# EAGLE design frames_v03 (EAGLE 5.09)

## Sheet 1 of 3
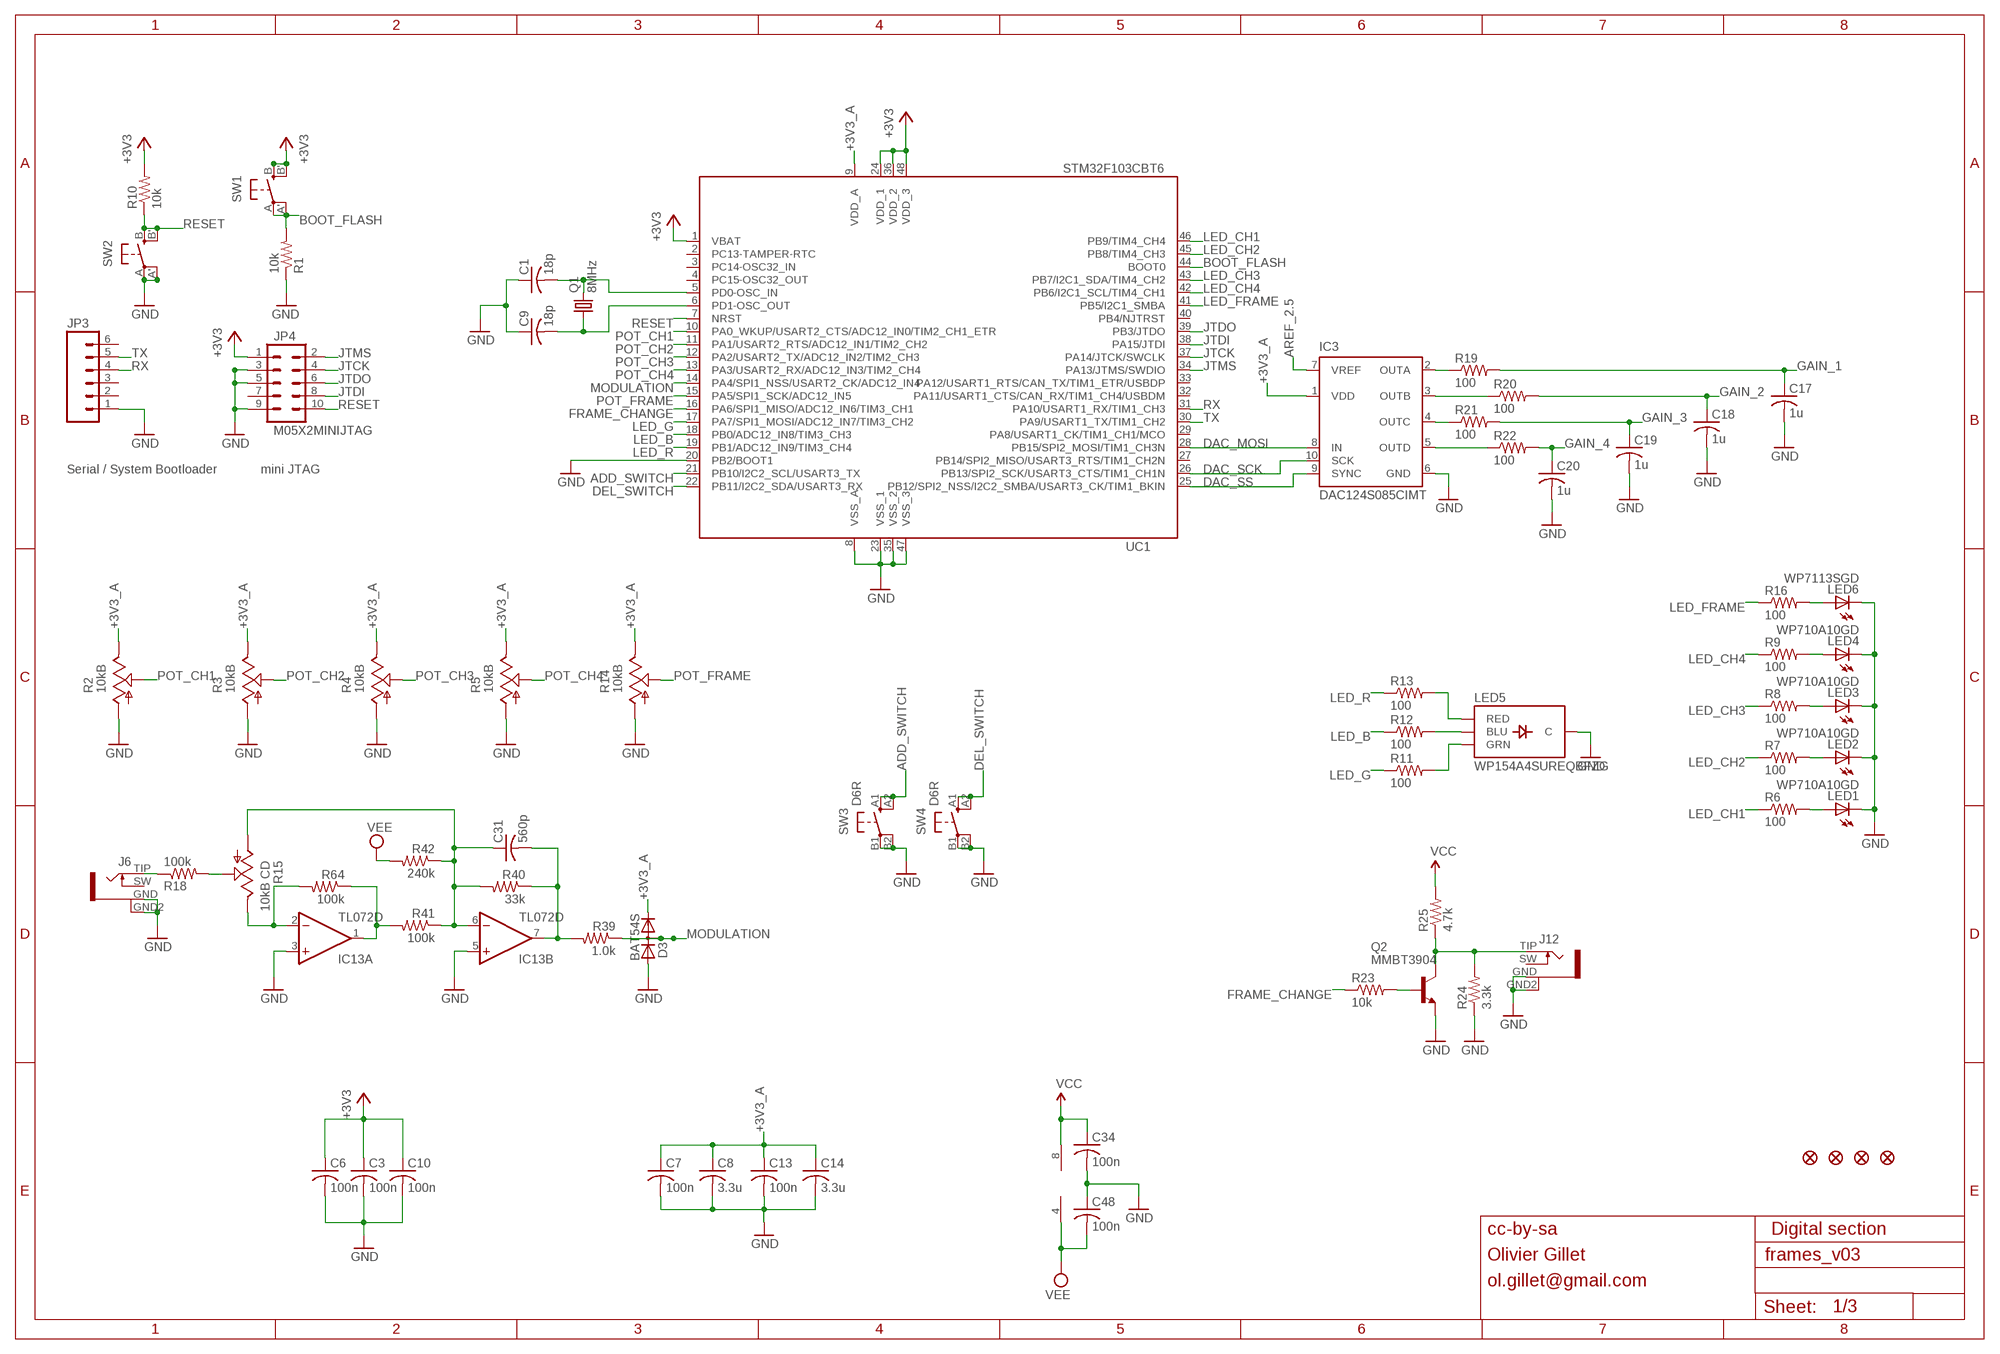
[diagram p0: schematic, sheet 1]

### Parts
C1  18p  C-USC0603  [C0603]
C3  100n  C-USC0603  [C0603]
C6  100n  C-USC0603  [C0603]
C7  100n  C-USC0603  [C0603]
C8  3.3u  C-USC0603  [C0603]
C9  18p  C-USC0603  [C0603]
C10  100n  C-USC0603  [C0603]
C13  100n  C-USC0603  [C0603]
C14  3.3u  C-USC0603  [C0603]
C17  1u  C-USC0603  [C0603]
C18  1u  C-USC0603  [C0603]
C19  1u  C-USC0603  [C0603]
C20  1u  C-USC0603  [C0603]
C31  560p  C-USC0603  [C0603]
C34  100n  C-USC0603  [C0603]
C48  100n  C-USC0603  [C0603]
D3  BAT54S  DIODE_2CACA-SOT23  [SOT23]
F1  FIDUCIAL1X2  [FIDUCIAL-1X2]
F2  FIDUCIAL1X2  [FIDUCIAL-1X2]
F3  FIDUCIAL1X2  [FIDUCIAL-1X2]
F4  FIDUCIAL1X2  [FIDUCIAL-1X2]
IC3  DAC124S085CIMT  [MSOP10]
IC13  TL072D  [SO08]
J6  PJ301WQP  [WQP_PJ_301BM]
J12  PJ301WQP  [WQP_PJ_301BM]
JP3  M06SIP  [1X06]
JP4  M05X2MINIJTAG  [2X5-1.27]
LED1  WP710A10GD  LED3MM  [LED3MM]
LED2  WP710A10GD  LED3MM  [LED3MM]
LED3  WP710A10GD  LED3MM  [LED3MM]
LED4  WP710A10GD  LED3MM  [LED3MM]
LED5  WP154A4SUREQBFZG  LED-TRICOLOR-THROUGHHOLE  [LED-TRICOLOR-THROUGHHOLE]
LED6  WP7113SGD  LED5MM  [LED5MM]
Q1  8MHz  CRYSTALHC49UP  [HC49UP]
Q2  MMBT3904  MMBT3904LT1-NPN-SOT23-BEC  [SOT23-BEC]
R1  10k  R-US_R0603  [R0603]
R2  10kB  POT_USVERTICAL_PS  [ALPS_POT_VERTICAL_PS]
R3  10kB  POT_USVERTICAL_PS  [ALPS_POT_VERTICAL_PS]
R4  10kB  POT_USVERTICAL_PS  [ALPS_POT_VERTICAL_PS]
R5  10kB  POT_USVERTICAL_PS  [ALPS_POT_VERTICAL_PS]
R6  100  R-US_R0603  [R0603]
R7  100  R-US_R0603  [R0603]
R8  100  R-US_R0603  [R0603]
R9  100  R-US_R0603  [R0603]
R10  10k  R-US_R0603  [R0603]
R11  100  R-US_R0603  [R0603]
R12  100  R-US_R0603  [R0603]
R13  100  R-US_R0603  [R0603]
R14  10kB  POT_USVERTICAL_PS  [ALPS_POT_VERTICAL_PS]
R15  10kB CD  POT_USVERTICAL_PS  [ALPS_POT_VERTICAL_PS]
R16  100  R-US_R0603  [R0603]
R18  100k  R-US_R0603  [R0603]
R19  100  R-US_R0603  [R0603]
R20  100  R-US_R0603  [R0603]
R21  100  R-US_R0603  [R0603]
R22  100  R-US_R0603  [R0603]
R23  10k  R-US_R0603  [R0603]
R24  3.3k  R-US_R0603  [R0603]
R25  4.7k  R-US_R0603  [R0603]
R39  1.0k  R-US_R0603  [R0603]
R40  33k  R-US_R0603  [R0603]
R41  100k  R-US_R0603  [R0603]
R42  240k  R-US_R0603  [R0603]
R64  100k  R-US_R0603  [R0603]
SW1  EVQQ2  [EVQ-Q2]
SW2  EVQQ2  [EVQ-Q2]
SW3  D6R  [D6R]
SW4  D6R  [D6R]
UC1  STM32F103CBT6  STM32F103CB  [LQFP48]

### Nets
+3V3: C3.1 C6.1 C10.1 JP4.1 R10.2 SW1.B'(S1) SW1.B(S) UC1.1(VBAT) UC1.24(VDD_1) UC1.36(VDD_2) UC1.48(VDD_3) ; also sheet 3
+3V3_A: C7.1 C8.1 C13.1 C14.1 D3.2(C) IC3.1(VDD) R2.P$1(E) R3.P$1(E) R4.P$1(E) R5.P$1(E) R14.P$1(E) UC1.9(VDD_A) ; also sheet 3
ADD_SWITCH: SW3.A1(S) SW3.A2(S1) UC1.21(PB10/I2C2_SCL/USART3_TX)
AREF_2.5: IC3.7(VREF) ; also sheet 3
BOOT_FLASH: R1.2 SW1.A'(P1) SW1.A(P) UC1.44(BOOT0)
DAC_MOSI: IC3.8(IN) UC1.28(PB15/SPI2_MOSI/TIM1_CH3N)
DAC_SCK: IC3.10(SCK) UC1.26(PB13/SPI2_SCK/USART3_CTS/TIM1_CH1N)
DAC_SS: IC3.9(SYNC) UC1.25(PB12/SPI2_NSS/I2C2_SMBA/USART3_CK/TIM1_BKIN)
DEL_SWITCH: SW4.A1(S) SW4.A2(S1) UC1.22(PB11/I2C2_SDA/USART3_RX)
FRAME_CHANGE: R23.1 UC1.16(PA6/SPI1_MISO/ADC12_IN6/TIM3_CH1)
GAIN_1: C17.1 R19.2 ; also sheet 2
GAIN_2: C18.1 R20.2 ; also sheet 2
GAIN_3: C19.1 R21.2 ; also sheet 2
GAIN_4: C20.1 R22.2 ; also sheet 2
GATE2_LED: LED3.A R8.2
GATE3_LED: LED2.A R7.2
GATE4_LED: LED1.A R6.2
GND: C1.1 C3.2 C6.2 C7.2 C8.2 C9.1 C10.2 C13.2 C14.2 C17.2 C18.2 C19.2 C20.2 C34.2 C48.1 D3.1(A) IC3.6(GND) IC13.3(A:+IN) IC13.5(B:+IN) J6.GND J6.GND2 J12.GND J12.GND2 JP3.1 JP4.3 JP4.5 JP4.9 LED1.K(C) LED2.K(C) LED3.K(C) LED4.K(C) LED5.GND(C) LED6.K(C) Q2.E R1.1 R2.P$3(A) R3.P$3(A) R4.P$3(A) R5.P$3(A) R14.P$3(A) R24.1 SW2.A'(P1) SW2.A(P) SW3.B1(P) SW3.B2(P1) SW4.B1(P) SW4.B2(P1) UC1.8(VSS_A) UC1.20(PB2/BOOT1) UC1.23(VSS_1) UC1.35(VSS_2) UC1.47(VSS_3) ; also sheet 2,3
JTCK: JP4.4 UC1.37(PA14/JTCK/SWCLK)
JTDI: JP4.8 UC1.38(PA15/JTDI)
JTDO: JP4.6 UC1.39(PB3/JTDO)
JTMS: JP4.2 UC1.34(PA13/JTMS/SWDIO)
LED_B: R12.1 UC1.18(PB0/ADC12_IN8/TIM3_CH3)
LED_CH1: R6.1 UC1.46(PB9/TIM4_CH4)
LED_CH2: R7.1 UC1.45(PB8/TIM4_CH3)
LED_CH3: R8.1 UC1.43(PB7/I2C1_SDA/TIM4_CH2)
LED_CH4: R9.1 UC1.42(PB6/I2C1_SCL/TIM4_CH1)
LED_FRAME: R16.1 UC1.41(PB5/I2C1_SMBA)
LED_G: R11.1 UC1.17(PA7/SPI1_MOSI/ADC12_IN7/TIM3_CH2)
LED_R: R13.1 UC1.19(PB1/ADC12_IN9/TIM3_CH4)
MODULATION: D3.3(AC) R39.1 UC1.14(PA4/SPI1_NSS/USART2_CK/ADC12_IN4)
N$1: IC13.2(A:-IN) R15.P$1(E) R64.2
N$5: R15.P$2(S) R18.2
N$6: LED4.A R9.2
N$7: C1.2 Q1.2 UC1.5(PD0-OSC_IN)
N$8: C9.2 Q1.1 UC1.6(PD1-OSC_OUT)
N$9: IC13.1(A:OUT) R41.2 R64.1
N$11: J6.TIP R18.1
N$13: C31.2 IC13.7(B:OUT) R39.2 R40.1
N$14: C31.1 IC13.6(B:-IN) R15.P$3(A) R40.2 R41.1 R42.1
N$25: LED6.A R16.2
N$35: LED5.RED R13.2
N$36: LED5.BLU R12.2
N$37: LED5.GRN R11.2
N$39: IC3.2(OUTA) R19.1
N$41: IC3.3(OUTB) R20.1
N$43: IC3.4(OUTC) R21.1
N$44: J12.TIP Q2.C R24.2 R25.1
N$45: IC3.5(OUTD) R22.1
N$47: Q2.B R23.2
POT_CH1: R2.P$2(S) UC1.10(PA0_WKUP/USART2_CTS/ADC12_IN0/TIM2_CH1_ETR)
POT_CH2: R3.P$2(S) UC1.11(PA1/USART2_RTS/ADC12_IN1/TIM2_CH2)
POT_CH3: R4.P$2(S) UC1.12(PA2/USART2_TX/ADC12_IN2/TIM2_CH3)
POT_CH4: R5.P$2(S) UC1.13(PA3/USART2_RX/ADC12_IN3/TIM2_CH4)
POT_FRAME: R14.P$2(S) UC1.15(PA5/SPI1_SCK/ADC12_IN5)
RESET: JP4.10 R10.1 SW2.B'(S1) SW2.B(S) UC1.7(NRST)
RX: JP3.4 UC1.31(PA10/USART1_RX/TIM1_CH3)
TX: JP3.5 UC1.30(PA9/USART1_TX/TIM1_CH2)
VCC: C34.1 IC13.8(P:V+) R25.2 ; also sheet 2,3
VEE: C48.2 IC13.4(P:V-) R42.2 ; also sheet 2,3
Unconnected: J6.SW J12.SW JP3.2 JP3.3 JP3.6 JP4.7 UC1.2(PC13-TAMPER-RTC) UC1.3(PC14-OSC32_IN) UC1.4(PC15-OSC32_OUT) UC1.27(PB14/SPI2_MISO/USART3_RTS/TIM1_CH2N) UC1.29(PA8/USART1_CK/TIM1_CH1/MCO) UC1.32(PA11/USART1_CTS/CAN_RX/TIM1_CH4/USBDM) UC1.33(PA12/USART1_RTS/CAN_TX/TIM1_ETR/USBDP) UC1.40(PB4/NJTRST)

### Notes on the sheet
- Serial / System Bootloader | mini JTAG
- cc-by-sa | Digital section
- Olivier Gillet
- ol.gillet@gmail.com

## Sheet 2 of 3
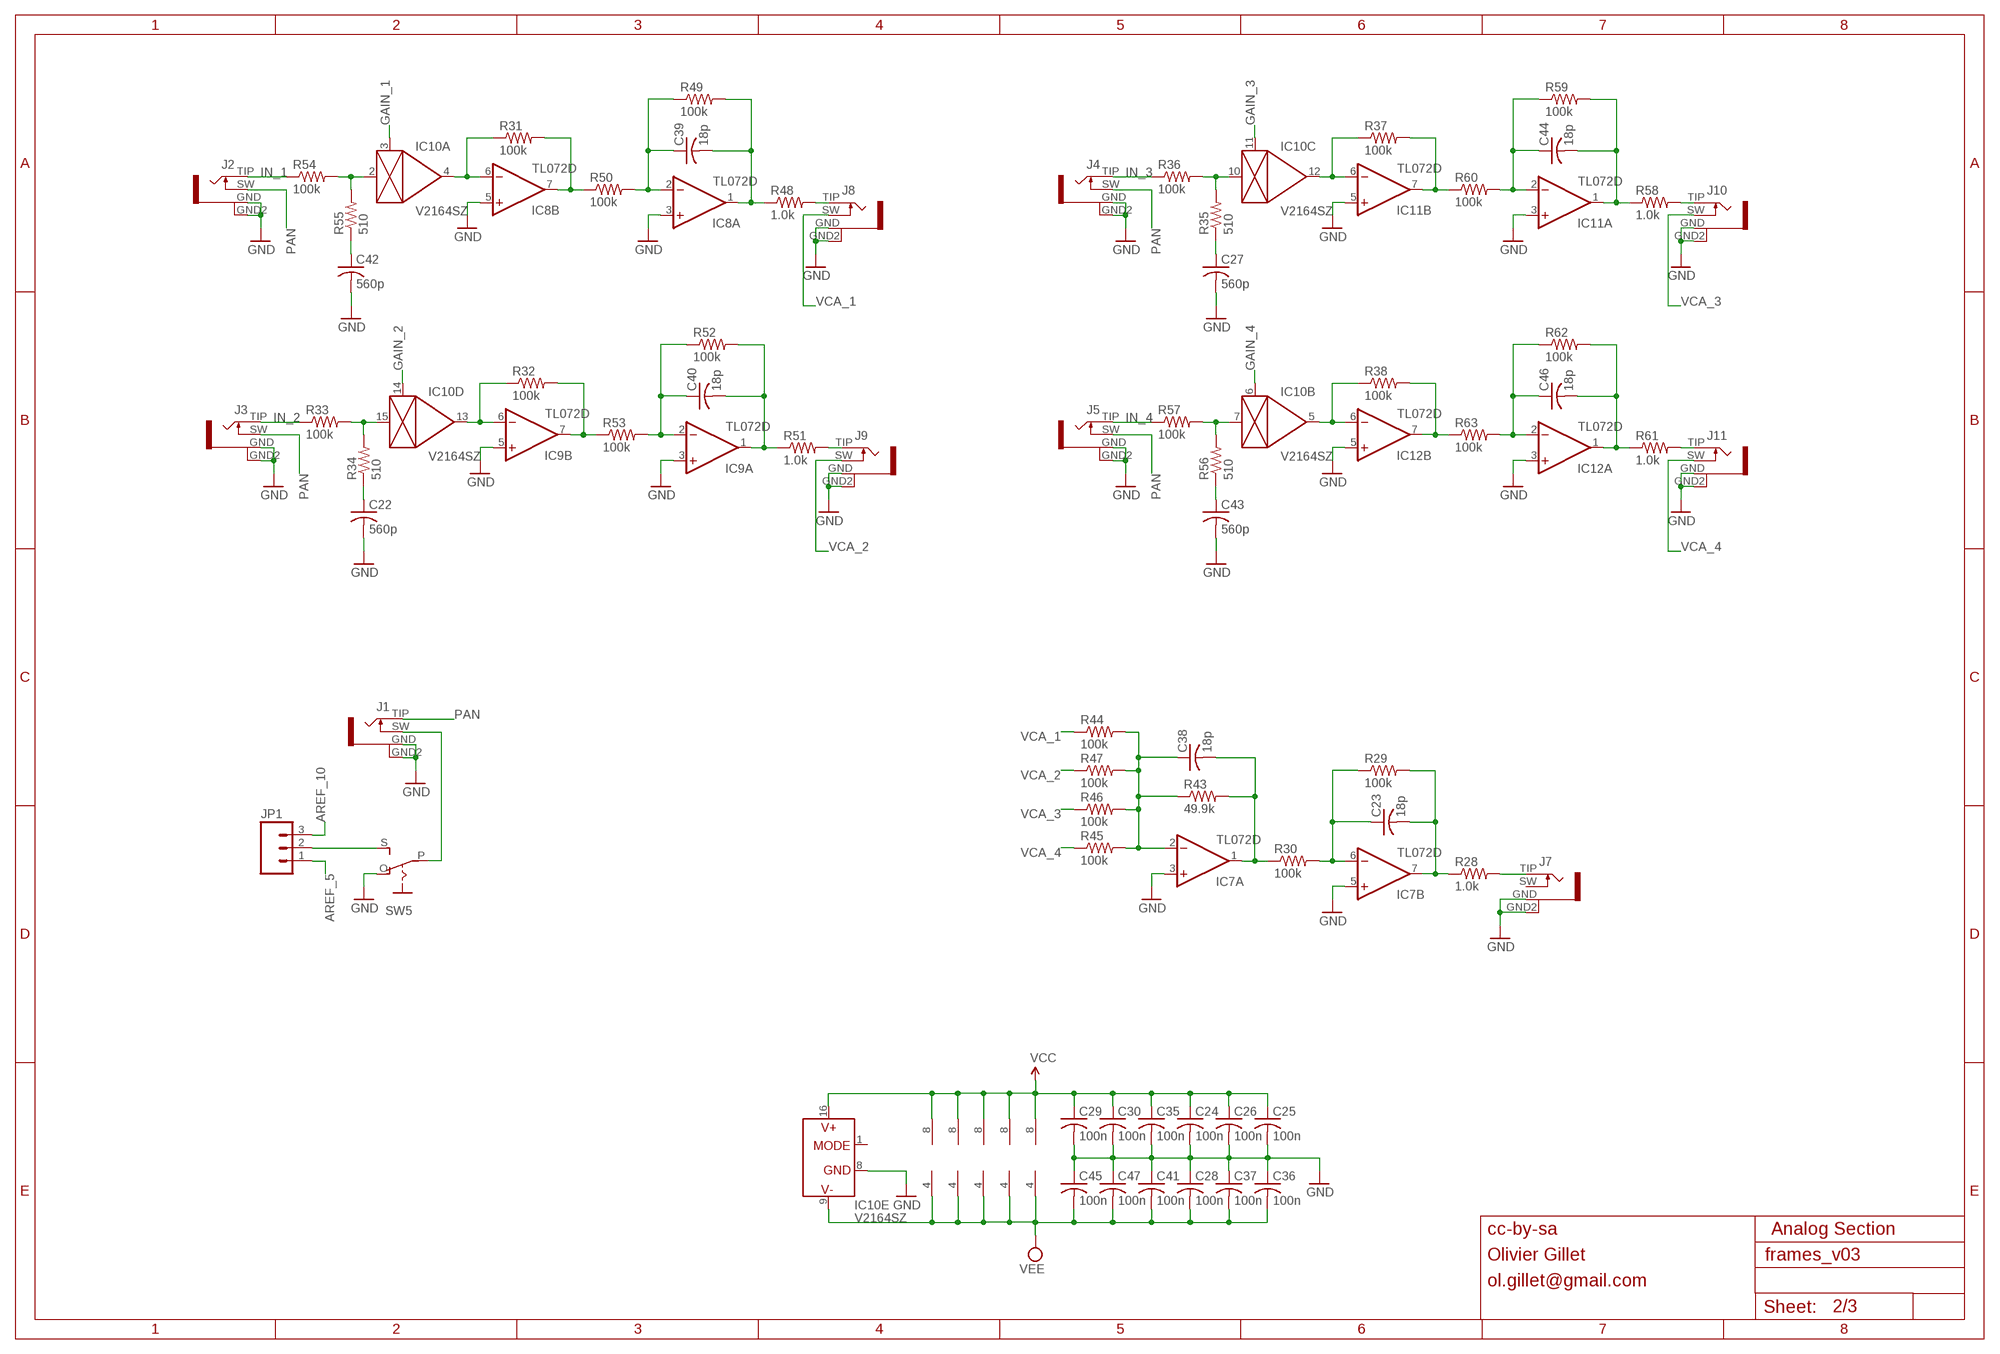
[diagram p1: schematic, sheet 2]

### Parts
C22  560p  C-USC0603  [C0603]
C23  18p  C-USC0603  [C0603]
C24  100n  C-USC0603  [C0603]
C25  100n  C-USC0603  [C0603]
C26  100n  C-USC0603  [C0603]
C27  560p  C-USC0603  [C0603]
C28  100n  C-USC0603  [C0603]
C29  100n  C-USC0603  [C0603]
C30  100n  C-USC0603  [C0603]
C35  100n  C-USC0603  [C0603]
C36  100n  C-USC0603  [C0603]
C37  100n  C-USC0603  [C0603]
C38  18p  C-USC0603  [C0603]
C39  18p  C-USC0603  [C0603]
C40  18p  C-USC0603  [C0603]
C41  100n  C-USC0603  [C0603]
C42  560p  C-USC0603  [C0603]
C43  560p  C-USC0603  [C0603]
C44  18p  C-USC0603  [C0603]
C45  100n  C-USC0603  [C0603]
C46  18p  C-USC0603  [C0603]
C47  100n  C-USC0603  [C0603]
IC7  TL072D  [SO08]
IC8  TL072D  [SO08]
IC9  TL072D  [SO08]
IC10  V2164SZ  SSM2164S  [SOIC16N]
IC11  TL072D  [SO08]
IC12  TL072D  [SO08]
J1  PJ301WQP  [WQP_PJ_301BM]
J2  PJ301WQP  [WQP_PJ_301BM]
J3  PJ301WQP  [WQP_PJ_301BM]
J4  PJ301WQP  [WQP_PJ_301BM]
J5  PJ301WQP  [WQP_PJ_301BM]
J7  PJ301WQP  [WQP_PJ_301BM]
J8  PJ301WQP  [WQP_PJ_301BM]
J9  PJ301WQP  [WQP_PJ_301BM]
J10  PJ301WQP  [WQP_PJ_301BM]
J11  PJ301WQP  [WQP_PJ_301BM]
JP1  M03PTH  [1X03]
R28  1.0k  R-US_R0603  [R0603]
R29  100k  R-US_R0603  [R0603]
R30  100k  R-US_R0603  [R0603]
R31  100k  R-US_R0603  [R0603]
R32  100k  R-US_R0603  [R0603]
R33  100k  R-US_R0603  [R0603]
R34  510  R-US_R0603  [R0603]
R35  510  R-US_R0603  [R0603]
R36  100k  R-US_R0603  [R0603]
R37  100k  R-US_R0603  [R0603]
R38  100k  R-US_R0603  [R0603]
R43  49.9k  R-US_R0603  [R0603]
R44  100k  R-US_R0603  [R0603]
R45  100k  R-US_R0603  [R0603]
R46  100k  R-US_R0603  [R0603]
R47  100k  R-US_R0603  [R0603]
R48  1.0k  R-US_R0603  [R0603]
R49  100k  R-US_R0603  [R0603]
R50  100k  R-US_R0603  [R0603]
R51  1.0k  R-US_R0603  [R0603]
R52  100k  R-US_R0603  [R0603]
R53  100k  R-US_R0603  [R0603]
R54  100k  R-US_R0603  [R0603]
R55  510  R-US_R0603  [R0603]
R56  510  R-US_R0603  [R0603]
R57  100k  R-US_R0603  [R0603]
R58  1.0k  R-US_R0603  [R0603]
R59  100k  R-US_R0603  [R0603]
R60  100k  R-US_R0603  [R0603]
R61  1.0k  R-US_R0603  [R0603]
R62  100k  R-US_R0603  [R0603]
R63  100k  R-US_R0603  [R0603]
SW5  S-ON-ONSMALL_SLIDE  [ES_100SP1T6B11M2QEH_SMALL]

### Nets
AREF_5: JP1.1 ; also sheet 3
AREF_10: JP1.3 ; also sheet 3
FB_CURRENT: IC10.2(A:IN) R54.2 R55.2
FB_CURRENT1: IC10.15(D:IN) R33.2 R34.2
FB_CURRENT2: IC10.10(C:IN) R35.2 R36.2
FB_CURRENT3: IC10.7(B:IN) R56.2 R57.2
GAIN_1: IC10.3(A:CTRL) ; also sheet 1
GAIN_2: IC10.14(D:CTRL) ; also sheet 1
GAIN_3: IC10.11(C:CTRL) ; also sheet 1
GAIN_4: IC10.6(B:CTRL) ; also sheet 1
GND: C22.2 C24.2 C25.2 C26.2 C27.2 C28.1 C29.2 C30.2 C35.2 C36.1 C37.1 C41.1 C42.2 C43.2 C45.1 C47.1 IC7.3(A:+IN) IC7.5(B:+IN) IC8.3(A:+IN) IC8.5(B:+IN) IC9.3(A:+IN) IC9.5(B:+IN) IC10.8(E:GND) IC11.3(A:+IN) IC11.5(B:+IN) IC12.3(A:+IN) IC12.5(B:+IN) J1.GND J1.GND2 J2.GND J2.GND2 J3.GND J3.GND2 J4.GND J4.GND2 J5.GND J5.GND2 J7.GND J7.GND2 J8.GND J8.GND2 J9.GND J9.GND2 J10.GND J10.GND2 J11.GND J11.GND2 SW5.O ; also sheet 1,3
IN_1: J2.TIP R54.1
IN_2: J3.TIP R33.1
IN_3: J4.TIP R36.1
IN_4: J5.TIP R57.1
N$2: C42.1 R55.1
N$3: J7.TIP R28.2
N$4: IC9.7(B:OUT) R32.2 R53.1
N$10: C27.1 R35.1
N$12: IC8.6(B:-IN) IC10.4(A:OUT) R31.1
N$15: C39.1 IC8.2(A:-IN) R49.1 R50.2
N$16: C39.2 IC8.1(A:OUT) R48.1 R49.2
N$17: C23.2 IC7.7(B:OUT) R28.1 R29.2
N$18: C22.1 R34.1
N$19: C38.1 IC7.2(A:-IN) R43.1 R44.2 R45.2 R46.2 R47.2
N$20: IC9.6(B:-IN) IC10.13(D:OUT) R32.1
N$21: C23.1 IC7.6(B:-IN) R29.1 R30.2
N$22: C40.1 IC9.2(A:-IN) R52.1 R53.2
N$23: C40.2 IC9.1(A:OUT) R51.1 R52.2
N$24: IC10.12(C:OUT) IC11.6(B:-IN) R37.1
N$26: C44.1 IC11.2(A:-IN) R59.1 R60.2
N$27: C44.2 IC11.1(A:OUT) R58.1 R59.2
N$28: C43.1 R56.1
N$29: C38.2 IC7.1(A:OUT) R30.1 R43.2
N$30: IC10.5(B:OUT) IC12.6(B:-IN) R38.1
N$32: C46.1 IC12.2(A:-IN) R62.1 R63.2
N$33: C46.2 IC12.1(A:OUT) R61.1 R62.2
N$34: J1.SW SW5.P
N$40: J8.TIP R48.2
N$42: JP1.2 SW5.S
N$48: IC12.7(B:OUT) R38.2 R63.1
N$49: J9.TIP R51.2
N$50: J11.TIP R61.2
N$51: J10.TIP R58.2
PAN: J1.TIP J2.SW J3.SW J4.SW J5.SW
VCA0_1: IC8.7(B:OUT) R31.2 R50.1
VCA0_3: IC11.7(B:OUT) R37.2 R60.1
VCA_1: J8.SW R44.1
VCA_2: J9.SW R47.1
VCA_3: J10.SW R46.1
VCA_4: J11.SW R45.1
VCC: C24.1 C25.1 C26.1 C29.1 C30.1 C35.1 IC7.8(P:V+) IC8.8(P:V+) IC9.8(P:V+) IC10.16(E:V+) IC11.8(P:V+) IC12.8(P:V+) ; also sheet 1,3
VEE: C28.2 C36.2 C37.2 C41.2 C45.2 C47.2 IC7.4(P:V-) IC8.4(P:V-) IC9.4(P:V-) IC10.9(E:V-) IC11.4(P:V-) IC12.4(P:V-) ; also sheet 1,3
Unconnected: IC10.1(E:MODE) J7.SW

### Notes on the sheet
- cc-by-sa | Analog Section
- Olivier Gillet
- ol.gillet@gmail.com

## Sheet 3 of 3
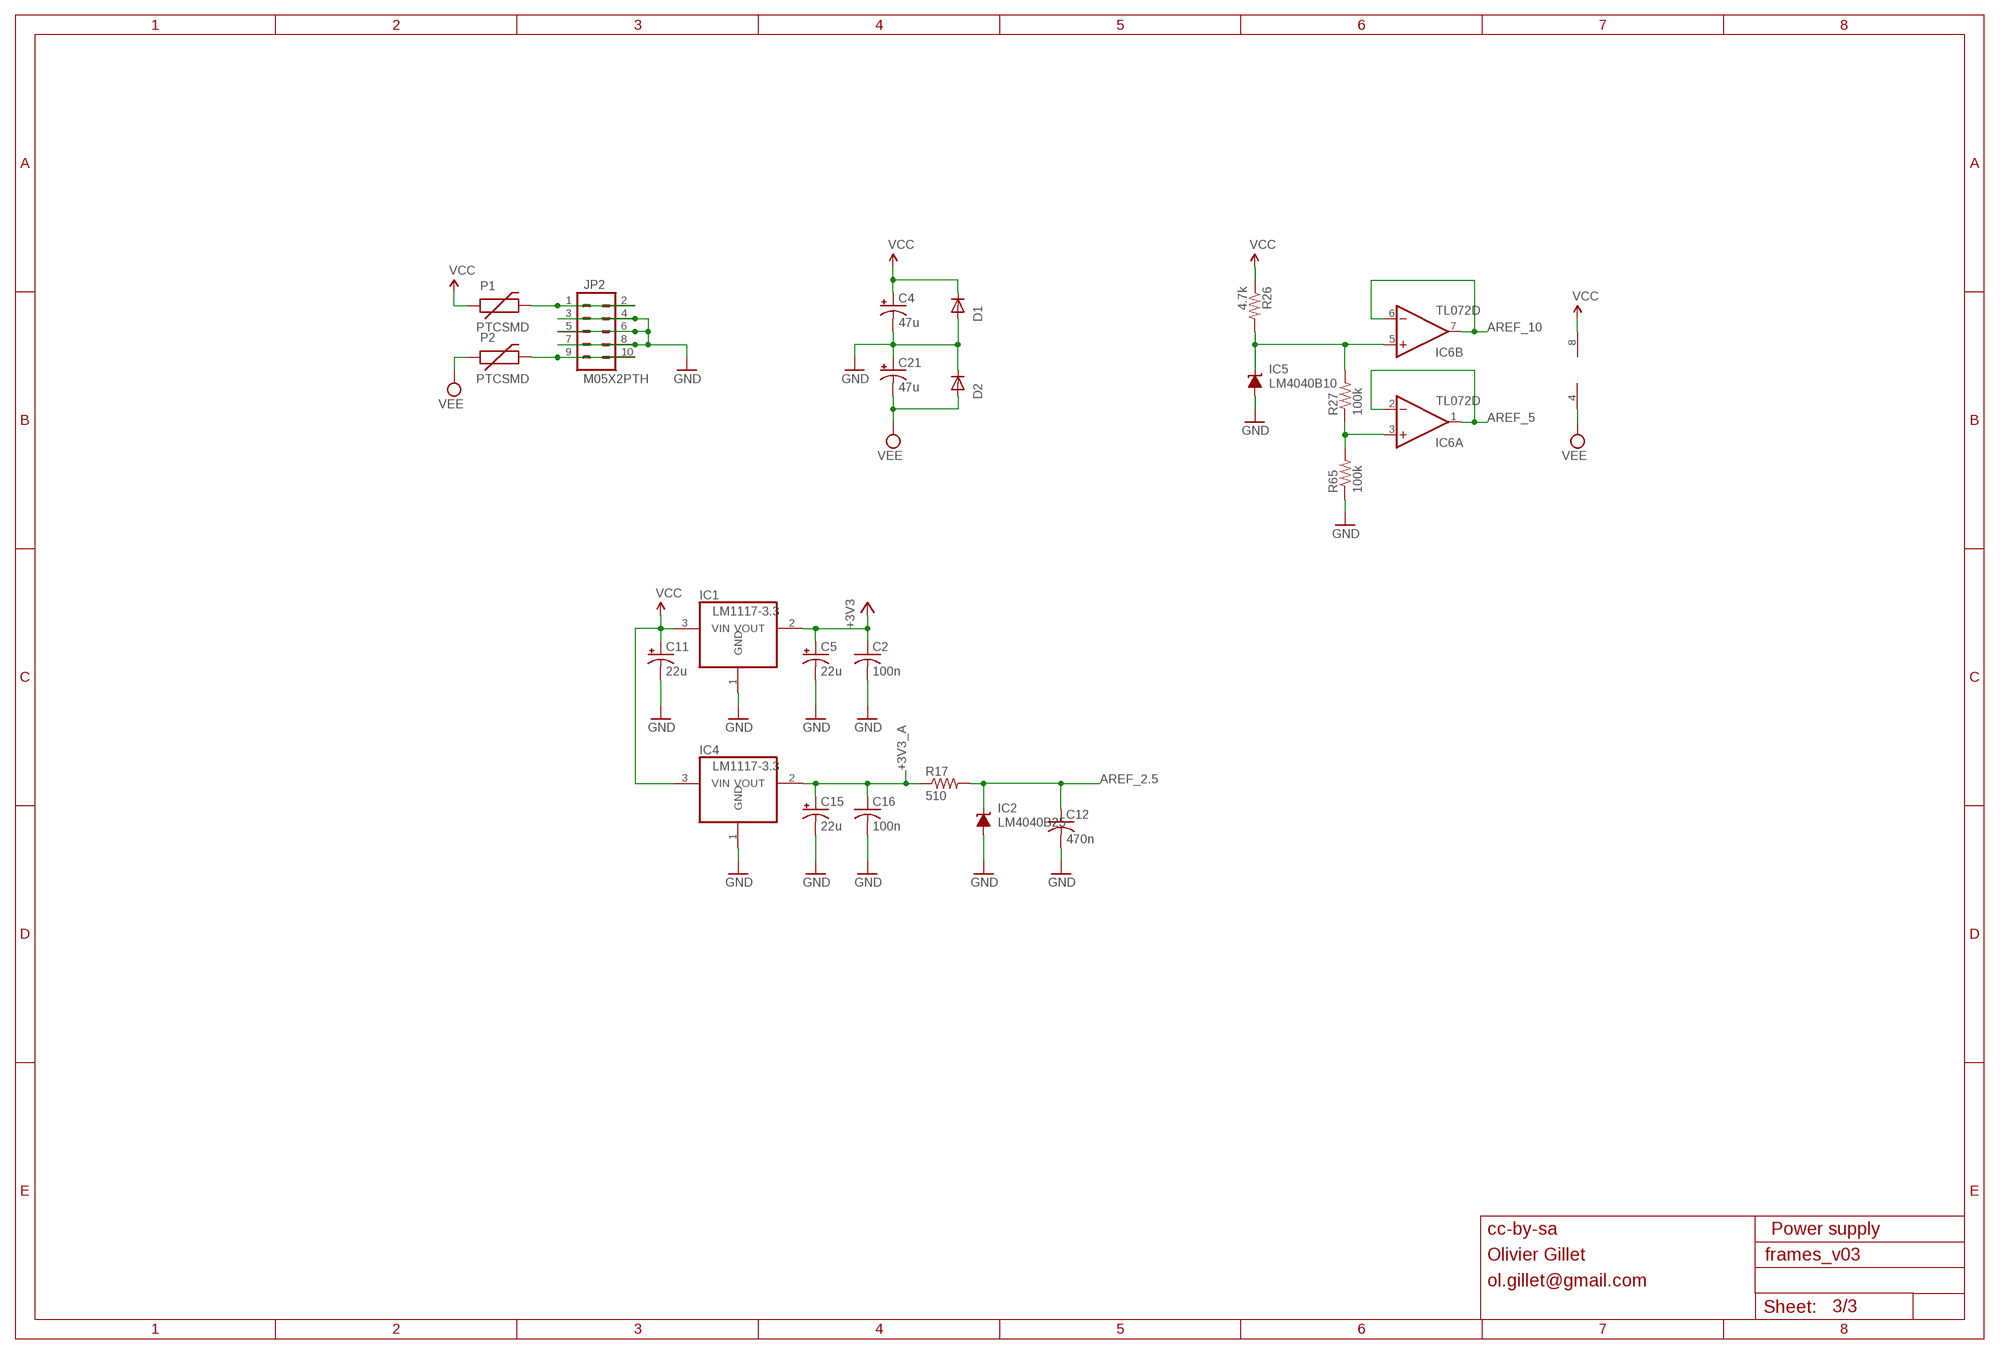
[diagram p2: schematic, sheet 3]

### Parts
C2  100n  C-USC0603  [C0603]
C4  47u  CPOL-USD  [PANASONIC_D]
C5  22u  CPOL-USC  [PANASONIC_C]
C11  22u  CPOL-USC  [PANASONIC_C]
C12  470n  C-USC0603  [C0603]
C15  22u  CPOL-USC  [PANASONIC_C]
C16  100n  C-USC0603  [C0603]
C21  47u  CPOL-USD  [PANASONIC_D]
D1  1N5819HW  DIODE-SOD123  [SOD123]
D2  1N5819HW  DIODE-SOD123  [SOD123]
IC1  LM1117-3.3  REG1117  [SOT223]
IC2  LM4040B25  LM4041B12DBZ  [DBZ_R-PDSO-G3]
IC4  LM1117-3.3  REG1117  [SOT223]
IC5  LM4040B10  LM4041B12DBZ  [DBZ_R-PDSO-G3]
IC6  TL072D  [SO08]
JP2  M05X2PTH  [AVR_ICSP]
P1  PTCSMD  [PTC-1206]
P2  PTCSMD  [PTC-1206]
R17  510  R-US_R0603  [R0603]
R26  4.7k  R-US_R0603  [R0603]
R27  100k  R-US_R0603  [R0603]
R65  100k  R-US_R0603  [R0603]

### Nets
+3V3: C2.1 C5.+ IC1.2(VOUT) ; also sheet 1
+3V3_A: C15.+ C16.1 IC4.2(VOUT) R17.1 ; also sheet 1
AREF_2.5: C12.1 IC2.1(C) R17.2 ; also sheet 1
AREF_5: IC6.1(A:OUT) IC6.2(A:-IN) ; also sheet 2
AREF_10: IC6.6(B:-IN) IC6.7(B:OUT) ; also sheet 2
AREF_10_0: IC5.1(C) IC6.5(B:+IN) R26.2 R27.2
GND: C2.2 C4.- C5.- C11.- C12.2 C15.- C16.2 C21.+ D1.A D2.C IC1.1(GND) IC2.2(A) IC4.1(GND) IC5.2(A) JP2.3 JP2.4 JP2.5 JP2.6 JP2.7 JP2.8 R65.1 ; also sheet 1,2
N$31: IC6.3(A:+IN) R27.1 R65.2
N$56: JP2.1 JP2.2 P1.2
N$64: JP2.9 JP2.10 P2.2
VCC: C4.+ C11.+ D1.C IC1.3(VIN) IC4.3(VIN) IC6.8(P:V+) P1.1 R26.1 ; also sheet 1,2
VEE: C21.- D2.A IC6.4(P:V-) P2.1 ; also sheet 1,2

### Notes on the sheet
- cc-by-sa | Power supply
- Olivier Gillet
- ol.gillet@gmail.com

## Library data of the parts
C1-C3 C6-C10 C12-C14 C16-C20 C22-C31 C34-C48 = rcl:C-US: CAPACITOR, American symbol
C4 C5 C11 C15 C21 = rcl:CPOL-US: POLARIZED CAPACITOR, American symbol
D1 D2 = diode:DIODE-: DIODE
D3 = diode:DIODE_2CACA-: 2 Diodes - Cathode-Anode|Cathode-Anode
F1-F4 = SparkFun:FIDUCIAL: Fiducial Alignment Points Various fiducial points for machine vision alignment.
IC1 IC4 = og-vreg:REG1117: 800mA and 1A Low Dropout (LDO) Positive Regulator 1.8V, 2.5V, 2.85V, 3.3V, 5V, and Adj
IC2 IC5 = texas:LM4041: PRECISION MICROPOWER SHUNT VOLTAGE REFERENCE Source: http://focus.ti.com/lit/ds/slcs146e/slcs146e.pdf
IC3 = og-dac:DAC124S085CIMT
IC6 = gm-ics:TL072: OP AMP
IC7-IC9 IC11-IC13 = og-linear:TL072: OP AMP
IC10 = ssm2164:SSM2164
J1-J12 = og-pj301:PJ301
JP1 = SparkFun:M03: Header 3 Standard 3-pin 0.1" header. Use with straight break away headers (SKU : PRT-00116), right angle break away headers (PRT-00553), swiss pins (PRT-00743), machine pins (PRT-00117), and female headers (PRT-00115). Molex polarized connector foot print use with SKU : PRT-08232 with associated crimp pins and housings.
JP2 JP4 = og-header:M05X2: Header 5x2 Standard 10-pin dual row 0.1" header. Commonly used with AVR-ISP. Use with Spark Fun Electronics SKU: PRT-00778
JP3 = SparkFun:M06: Header 6 Standard 6-pin 0.1" header. Use with straight break away headers (SKU : PRT-00116), right angle break away headers (PRT-00553), swiss pins (PRT-00743), machine pins (PRT-00117), and female headers (PRT-00115). Molex polarized connector foot print use with SKU : PRT-08094 with associated crimp pins and housings. NOTES ON THE VARIANTS LOCK and LOCK_LONGPADS... This footprint was designed to help hold the alignment of a through-hole component (i.e. 6-pin header) while soldering it into place. You may notice that each hole has been shifted either up or down by 0.005 of an inch from it's more standard position (which is a perfectly straight line). This slight alteration caused the pins (the squares in the middle) to touch the edges of the holes. Because they are alternating, it causes a "brace" to hold the component in place. 0.005 has proven to be the perfect amount of "off-center" position when using our standard breakaway headers. Although looks a little odd when you look at the bare footprint, once you have a header in there, the alteration is very hard to notice. Also, if you push a header all the way into place, it is covered up entirely on the bottom side. This idea of altering the position of holes to aid alignment will be further integrated into the Sparkfun Library for other footprints. It can help hold any component with 3 or more connection pins.
LED1-LED4 LED6 = led:LED: LED OSRAM: - CHIPLED LG R971, LG N971, LY N971, LG Q971, LY Q971, LO R971, LY R971 LH N974, LH R974 LS Q976, LO Q976, LY Q976 LO Q996 - Hyper CHIPLED LW Q18S LB Q993, LB Q99A, LB R99A - SideLED LS A670, LO A670, LY A670, LG A670, LP A670 LB A673, LV A673, LT A673, LW A673 LH A674 LY A675 LS A676, LA A676, LO A676, LY A676, LW A676 LS A679, LY A679, LG A679 - Hyper Micro SIDELED® LS Y876, LA Y876, LO Y876, LY Y876 LT Y87S - SmartLED LW L88C, LW L88S LB L89C, LB L89S, LG L890 LS L89K, LO L89K, LY L89K LS L896, LA L896, LO L896, LY L896 - TOPLED LS T670, LO T670, LY T670, LG T670, LP T670 LSG T670, LSP T670, LSY T670, LOP T670, LYG T670 LG T671, LOG T671, LSG T671 LB T673, LV T673, LT T673, LW T673 LH T674 LS T676, LA T676, LO T676, LY T676, LB T676, LH T676, LSB T676, LW T676 LB T67C, LV T67C, LT T67C, LS T67K, LO T67K, LY T67K, LW E67C LS E67B, LA E67B, LO E67B, LY E67B, LB E67C, LV E67C, LT E67C LW T67C LS T679, LY T679, LG T679 LS T770, LO T770, LY T770, LG T770, LP T770 LB T773, LV T773, LT T773, LW T773 LH T774 LS E675, LA E675, LY E675, LS T675 LS T776, LA T776, LO T776, LY T776, LB T776 LHGB T686 LT T68C, LB T68C - Hyper Mini TOPLED® LB M676 - Mini TOPLED Santana® LG M470 LS M47K, LO M47K, LY M47K Source: http://www.osram.convergy.de LUXEON: - LUMILED® LXK2-PW12-R00, LXK2-PW12-S00, LXK2-PW14-U00, LXK2-PW14-V00 LXK2-PM12-R00, LXK2-PM12-S00, LXK2-PM14-U00 LXK2-PE12-Q00, LXK2-PE12-R00, LXK2-PE12-S00, LXK2-PE14-T00, LXK2-PE14-U00 LXK2-PB12-K00, LXK2-PB12-L00, LXK2-PB12-M00, LXK2-PB14-N00, LXK2-PB14-P00, LXK2-PB14-Q00 LXK2-PR12-L00, LXK2-PR12-M00, LXK2-PR14-Q00, LXK2-PR14-R00 LXK2-PD12-Q00, LXK2-PD12-R00, LXK2-PD12-S00 LXK2-PH12-R00, LXK2-PH12-S00 LXK2-PL12-P00, LXK2-PL12-Q00, LXK2-PL12-R00 Source: www.luxeon.com KINGBRIGHT: KA-3528ASYC Source: www.kingbright.com
LED5 = og-leds:LED-TRICOLOR-THROUGHHOLE
P1 P2 = SparkFun:PTC: Resettable Fuse PTC Resettable Fuse. Spark Fun Electronics SKU : COM-08357
Q1 = crystal:CRYSTAL: CRYSTAL
Q2 = transistor:*-NPN-: NPN Transistror BF959 corrected 2008.03.06
R1 R6-R13 R16-R65 = rcl:R-US_: RESISTOR, American symbol
R2-R5 R14 R15 = pot-alps:POT_US
SW1 SW2 = adafruit:EVQQ2: SMT 6mm switch, EVQQ2 series http://www.ladyada.net/library/eagle
SW3 SW4 = og-switch:D6R: C&K D6R
SW5 = og-switch:S-ON-ON: On-on Switch
UC1 = stm32:STM32F103CB

## Board
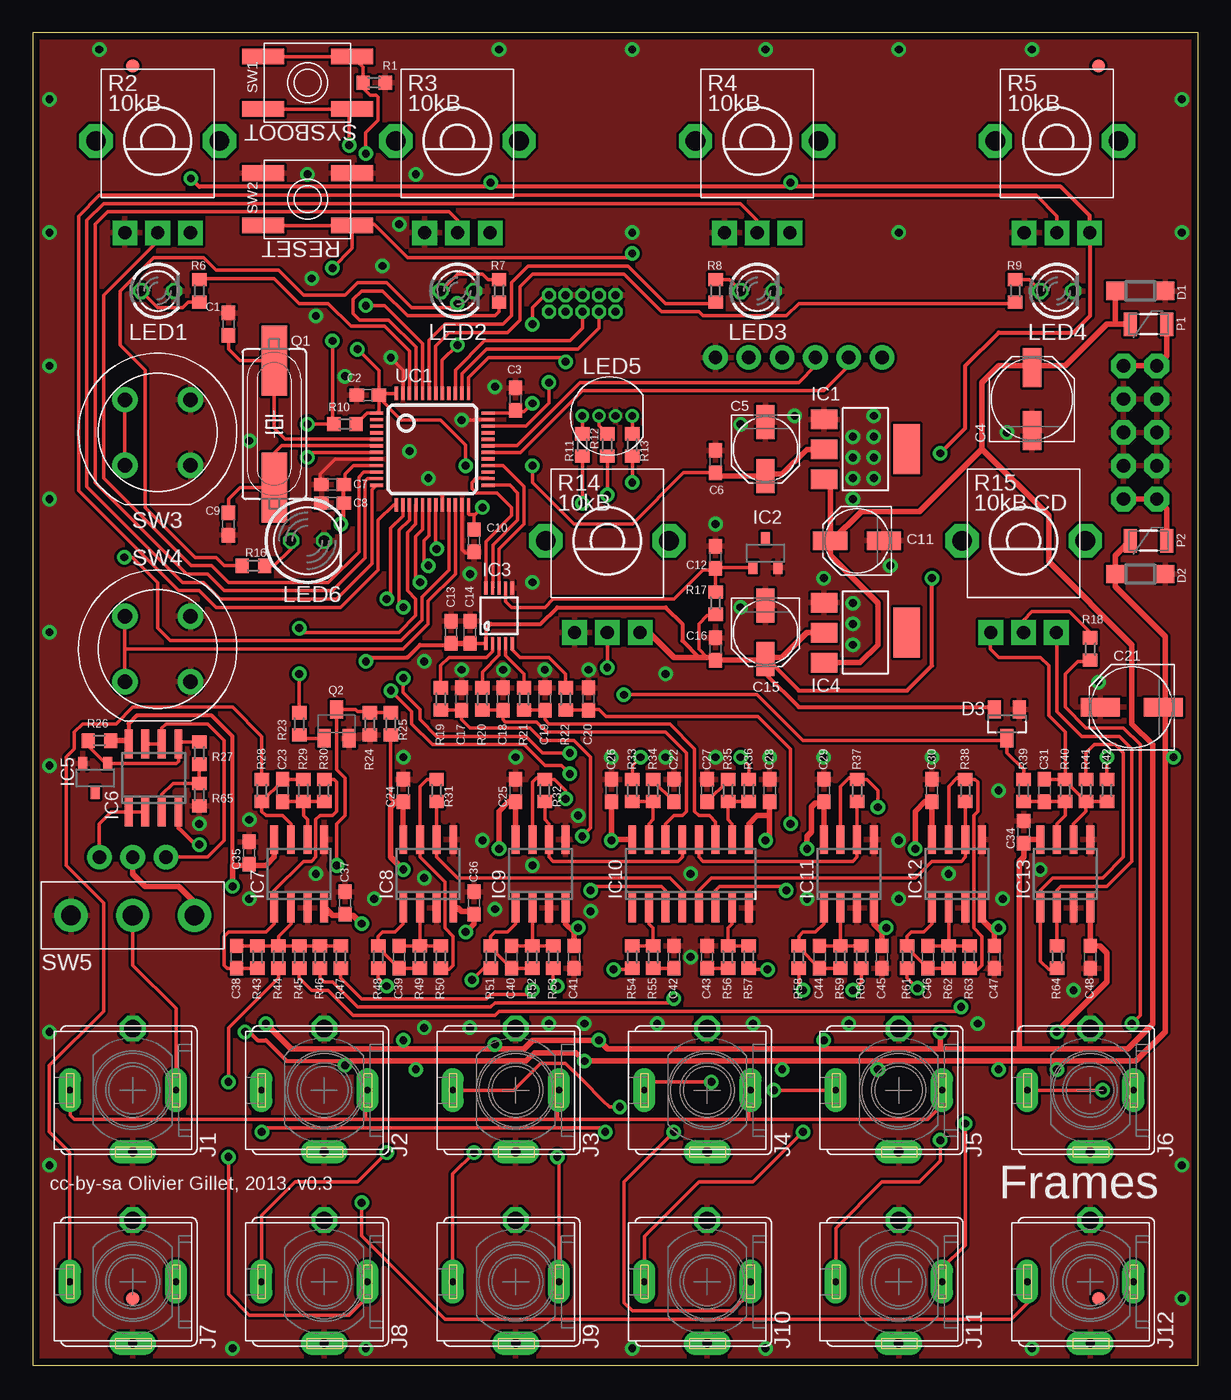
[diagram p3: board, top side]
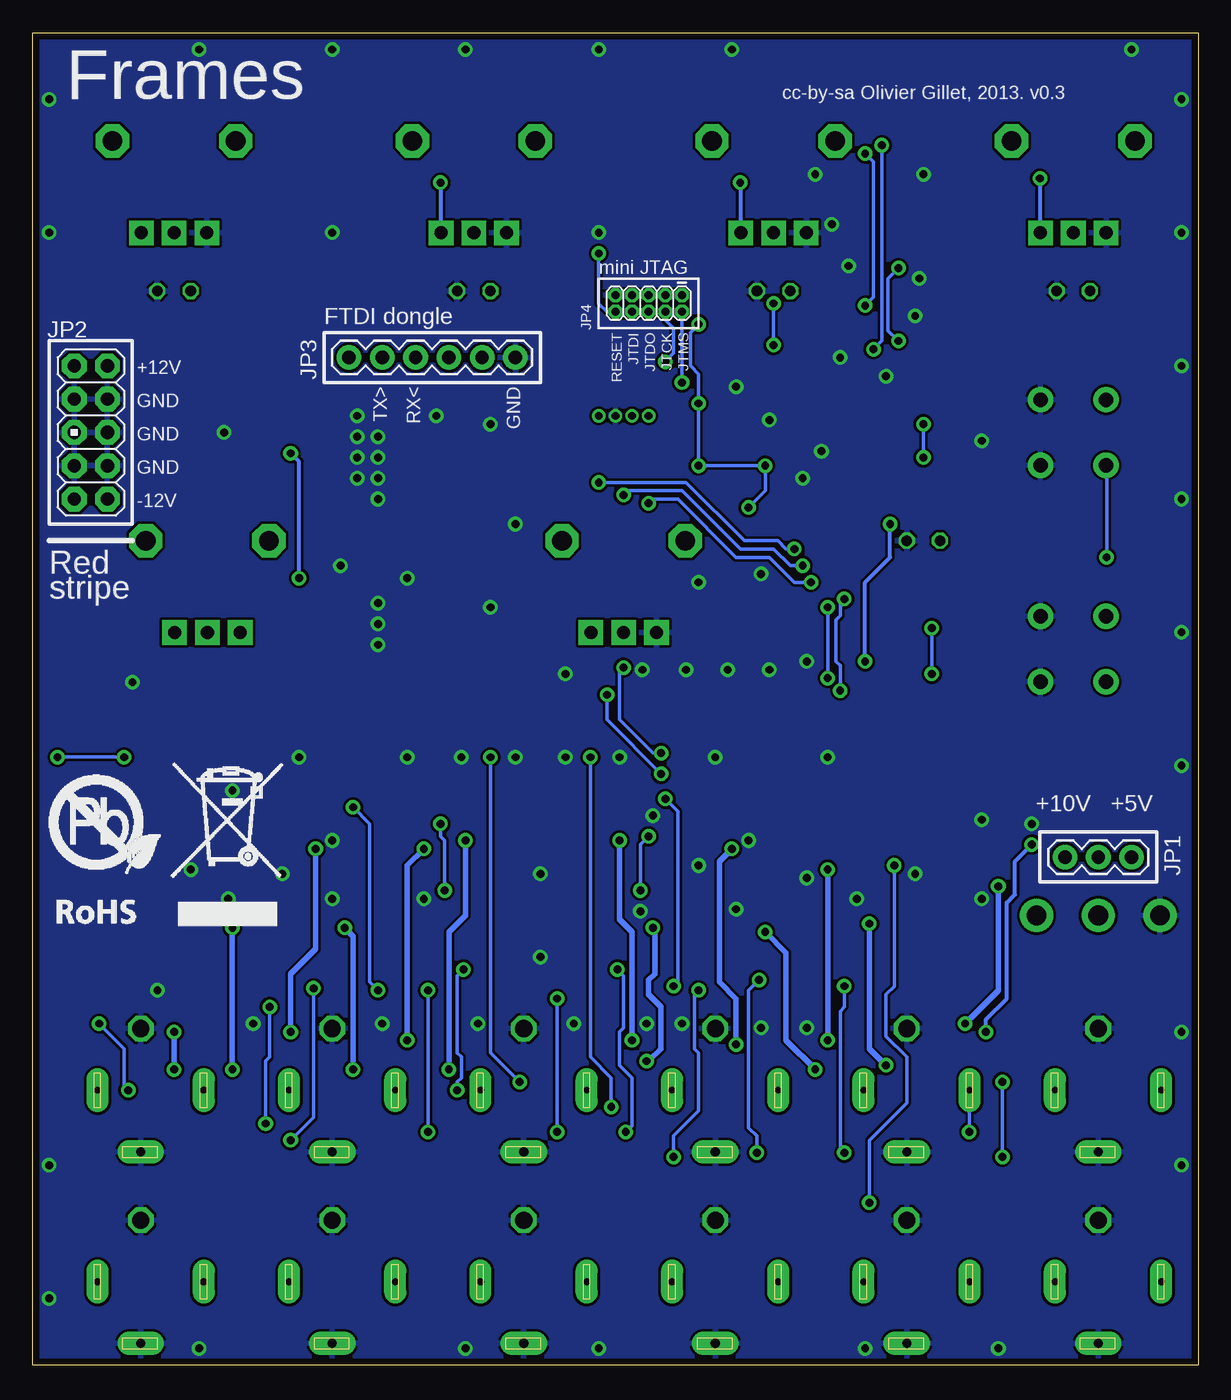
[diagram p4: board, bottom side, seen from below]

Size 88.88 x 101.6 mm. Coordinates in mm from the lower left corner, seen from the top.
Outline: 0,0 88.88,0 88.88,101.6 0,101.6 0,0
Copper layers (1*16): Top 0.035mm / dielectric 1.5mm / Bottom 0.035mm
Design rules "PCBCart-Standard": minimum track width 8mil, minimum drill 0.4mm, track to track 8mil, track to pad 8mil, pad to pad 8mil, via to via 8mil, smd to smd 8mil, copper to edge 20mil, drill to drill 8mil, minimum pad ring 8mil, minimum via ring 10mil, stop-mask expansion 3mil, vias tented up to drill 25mil, thermal gap 8mil

### Footprints (pad centres in the part's own frame; a part is rotated, then mirrored left to right if it is on the bottom)
C0603 = smd 1.1 x 1: 1 -0.85,0; 2 0.85,0
PANASONIC_D = smd 3 x 1.4: + 2.4,0; - -2.4,0
PANASONIC_C = smd 2.6 x 1.4: + 2.05,0; - -2.05,0
SOD123 = smd 1.4 x 1.4: A 1.9,0; C -1.9,0
SOT23 = smd 1 x 1.4: 1 -0.95,-1.1; 2 0.95,-1.1; 3 0,1.1
FIDUCIAL-1X2 = smd 1 x 1: 1 0,0
SOT223 = smd 1.499 x 2.007: 1 -2.261,-3.15; 2 0.025,-3.15; 3 2.311,-3.15 | smd 3.81 x 2.007: 4 0,3.15
DBZ_R-PDSO-G3 = smd 0.7 x 1: 1 -0.95,-1.1; 2 0.95,-1.1; 3 0,1.1
MSOP10 = smd 0.25 x 1: 1 -1,-2.113; 2 -0.5,-2.113; 3 0,-2.113; 4 0.5,-2.113; 5 1,-2.113; 6 1,2.113; 7 0.5,2.113; 8 0,2.113; 9 -0.5,2.113; 10 -1,2.113
SO08 = smd 0.6 x 2.2: 1 -1.905,-2.6; 2 -0.635,-2.6; 3 0.635,-2.6; 4 1.905,-2.6; 5 1.905,2.6; 6 0.635,2.6; 7 -0.635,2.6; 8 -1.905,2.6
SOIC16N = smd 0.6 x 2.2: 1 -4.445,-2.6; 2 -3.175,-2.6; 3 -1.905,-2.6; 4 -0.635,-2.6; 5 0.635,-2.6; 6 1.905,-2.6; 7 3.175,-2.6; 8 4.445,-2.6; 9 4.445,2.6; 10 3.175,2.6; 11 1.905,2.6; 12 0.635,2.6; 13 -0.635,2.6; 14 -1.905,2.6; 15 -3.175,2.6; 16 -4.445,2.6
WQP_PJ_301BM = drill 0.7 pad 1.778 long: GND -4.7,0 | drill 1.3 octagon: GND2 4.7,0 | drill 0.508 pad 1.676 long: SW 0,-3.3; TIP 0,4.8
1X03 = drill 1.016 pad 1.88 round: 1 0,0; 2 2.54,0; 3 5.08,0
AVR_ICSP = drill 1.016 pad 1.88 octagon: 1 -1.27,5.08; 2 1.27,5.08; 3 -1.27,2.54; 4 1.27,2.54; 5 -1.27,0; 6 1.27,0; 7 -1.27,-2.54; 8 1.27,-2.54; 9 -1.27,-5.08; 10 1.27,-5.08
1X06 = drill 1.016 pad 1.88 round: 1 0,0; 2 2.54,0; 3 5.08,0; 4 7.62,0; 5 10.16,0; 6 12.7,0
2X5-1.27 = drill 0.61 pad 1.067 octagon: 1 -1.27,3.81; 2 0,3.81; 3 -1.27,2.54; 4 0,2.54; 5 -1.27,1.27; 6 0,1.27; 7 -1.27,0; 8 0,0; 9 -1.27,-1.27; 10 0,-1.27
LED3MM = drill 0.813 octagon: A -1.27,0; K 1.27,0
LED-TRICOLOR-THROUGHHOLE = drill 0.6 round: BLU 0.635,0; GND -0.635,0; GRN 1.905,0; RED -1.905,0
LED5MM = drill 0.813 octagon: A -1.27,0; K 1.27,0
PTC-1206 = smd 1 x 1.8: 1 -1.4,0; 2 1.4,0
HC49UP = smd 5.334 x 1.93: 1 -4.826,0; 2 4.826,0
SOT23-BEC = smd 1 x 1.4: B -0.95,-1.1; C 0,1.1; E 0.95,-1.1
R0603 = smd 1 x 1.1: 1 -0.85,0; 2 0.85,0
ALPS_POT_VERTICAL_PS = drill 1 pad 1.88 square: P$1 -2.5,7; P$2 0,7; P$3 2.5,7 | drill 1.5 pad 2.54 octagon: P$4 -4.7,0; P$5 4.7,0
EVQ-Q2 = smd 3.2 x 1.2: A -3.4,-2; A' 3.4,-2; B -3.4,2; B' 3.4,2
D6R = drill 1.1 pad 1.93 round: A1 -2.5,2.5; A2 2.5,2.5; B1 -2.5,-2.5; B2 2.5,-2.5
ES_100SP1T6B11M2QEH_SMALL = drill 1.5 pad 2.54 round: O -4.699,0; P 0,0; S 4.699,0
LQFP48 = smd 0.254 x 1: 1 -2.75,-4.25; 2 -2.25,-4.25; 3 -1.75,-4.25; 4 -1.25,-4.25; 5 -0.75,-4.25; 6 -0.25,-4.25; 7 0.25,-4.25; 8 0.75,-4.25; 9 1.25,-4.25; 10 1.75,-4.25; 11 2.25,-4.25; 12 2.75,-4.25; 25 2.75,4.25; 26 2.25,4.25; 27 1.75,4.25; 28 1.25,4.25; 29 0.75,4.25; 30 0.25,4.25; 31 -0.25,4.25; 32 -0.75,4.25; 33 -1.25,4.25; 34 -1.75,4.25; 35 -2.25,4.25; 36 -2.75,4.25 | smd 1 x 0.254: 13 4.25,-2.75; 14 4.25,-2.25; 15 4.25,-1.75; 16 4.25,-1.25; 17 4.25,-0.75; 18 4.25,-0.25; 19 4.25,0.25; 20 4.25,0.75; 21 4.25,1.25; 22 4.25,1.75; 23 4.25,2.25; 24 4.25,2.75; 37 -4.25,2.75; 38 -4.25,2.25; 39 -4.25,1.75; 40 -4.25,1.25; 41 -4.25,0.75; 42 -4.25,0.25; 43 -4.25,-0.25; 44 -4.25,-0.75; 45 -4.25,-1.25; 46 -4.25,-1.75; 47 -4.25,-2.25; 48 -4.25,-2.75

### Placement (x,y rotation side)
C1  14.92,79.38 270 top
C2  25.56,73.98 180 top
C3  36.83,73.66 90 top
C4  76.2,73.66 90 top
C5  55.88,69.85 270 top
C6  52.07,68.9 90 top
C7  22.86,67.15 180 top
C8  22.86,65.72 180 top
C9  14.92,64.14 90 top
C10  33.66,62.87 270 top
C11  62.87,62.87 180 top
C12  52.07,61.59 90 top
C13  31.91,55.88 90 top
C14  33.34,55.88 90 top
C15  55.88,55.88 270 top
C16  52.07,54.61 90 top
C17  32.7,50.8 90 top
C18  35.88,50.8 90 top
C19  39.05,50.8 90 top
C20  42.39,50.8 90 top
C21  83.82,50.16 180 top
C22  48.9,43.82 90 top
C23  19.05,43.81 90 top
C24  28.26,43.81 90 top
C25  36.83,43.81 90 top
C26  44.13,43.81 90 top
C27  51.44,43.81 90 top
C28  56.2,43.81 270 top
C29  60.33,43.81 90 top
C30  68.58,43.81 90 top
C31  77.15,43.81 270 top
C34  75.56,40.64 90 top
C35  16.51,39.05 90 top
C36  33.66,35.24 270 top
C37  23.81,35.24 270 top
C38  15.56,31.11 270 top
C39  27.94,31.11 270 top
C40  36.51,31.11 270 top
C41  41.27,31.11 90 top
C42  48.9,31.11 90 top
C43  51.44,31.11 90 top
C44  60.01,31.11 270 top
C45  64.77,31.11 90 top
C46  68.26,31.11 270 top
C47  73.34,31.11 90 top
C48  80.64,31.11 90 top
D1  84.45,81.92 0 top
D2  84.45,60.33 180 top
D3  74.3,48.9 180 top
F1  7.62,99.06 0 top
F2  81.28,99.06 0 top
F3  7.62,5.08 0 top
F4  81.28,5.08 0 top
IC1  63.5,69.85 270 top
IC2  55.88,61.91 0 top
IC3  35.56,57.15 0 top
IC4  63.5,55.88 270 top
IC5  4.76,44.77 180 top
IC6  9.21,44.77 0 top
IC7  20.32,37.47 0 top
IC8  30.16,37.47 0 top
IC9  38.73,37.47 0 top
IC10  50.16,37.47 0 top
IC11  62.23,37.47 0 top
IC12  70.48,37.47 0 top
IC13  78.74,37.47 0 top
J1  7.62,20.95 90 top
J2  22.23,20.95 90 top
J3  36.83,20.95 90 top
J4  51.44,20.95 90 top
J5  66.04,20.95 90 top
J6  80.64,20.95 90 top
J7  7.62,6.35 90 top
J8  22.23,6.35 90 top
J9  36.83,6.35 90 top
J10  51.44,6.35 90 top
J11  66.04,6.35 90 top
J12  80.64,6.35 90 top
JP1  5.08,38.73 180 bottom
JP2  84.45,71.12 0 bottom
JP3  52.07,76.83 180 bottom
JP4  43.18,80.33 270 bottom
LED1  9.53,81.92 0 top
LED2  32.38,81.92 0 top
LED3  55.24,81.92 0 top
LED4  78.11,81.92 0 top
LED5  43.81,72.39 180 top
LED6  20.95,62.87 0 top
P1  85.09,79.38 0 top
P2  85.09,62.87 0 top
Q1  18.41,71.75 90 top
Q2  23.18,48.9 0 top
R1  26.04,97.79 180 top
R2  9.53,93.34 180 top
R3  32.38,93.34 180 top
R4  55.24,93.34 180 top
R5  78.11,93.34 180 top
R6  12.7,81.92 270 top
R7  35.56,81.92 90 top
R8  52.07,81.92 90 top
R9  74.93,81.92 90 top
R10  23.81,71.75 0 top
R11  41.91,70.17 90 top
R12  43.81,70.17 90 top
R13  45.72,70.17 90 top
R14  43.81,62.87 180 top
R15  75.56,62.87 180 top
R16  16.83,60.96 0 top
R17  52.07,58.1 90 top
R18  80.64,54.61 90 top
R19  31.11,50.8 270 top
R20  34.29,50.8 270 top
R21  37.47,50.8 270 top
R22  40.64,50.8 270 top
R23  20.32,48.9 270 top
R24  25.72,48.9 90 top
R25  27.3,48.9 270 top
R26  5.08,47.62 180 top
R27  12.7,46.67 90 top
R28  17.46,43.81 90 top
R29  20.64,43.81 90 top
R30  22.23,43.81 270 top
R31  30.8,43.81 90 top
R32  39.05,43.81 90 top
R33  45.72,43.81 270 top
R34  47.31,43.81 270 top
R35  53.02,43.81 270 top
R36  54.61,43.81 270 top
R37  62.87,43.81 90 top
R38  71.12,43.81 90 top
R39  75.56,43.81 270 top
R40  78.74,43.81 90 top
R41  80.33,43.81 90 top
R42  81.92,43.81 90 top
R43  17.14,31.11 270 top
R44  18.73,31.11 90 top
R45  20.32,31.11 90 top
R46  21.91,31.11 90 top
R47  23.5,31.11 90 top
R48  26.35,31.11 270 top
R49  29.53,31.11 270 top
R50  31.11,31.11 90 top
R51  34.92,31.11 270 top
R52  38.1,31.11 270 top
R53  39.69,31.11 90 top
R54  45.72,31.11 90 top
R55  47.31,31.11 90 top
R56  53.02,31.11 90 top
R57  54.61,31.11 90 top
R58  58.42,31.11 270 top
R59  61.59,31.11 270 top
R60  63.18,31.11 90 top
R61  66.67,31.11 270 top
R62  69.85,31.11 270 top
R63  71.44,31.11 90 top
R64  78.11,31.11 90 top
R65  12.7,43.5 90 top
SW1  20.95,97.79 180 top
SW2  20.95,88.9 180 top
SW3  9.53,71.12 90 top
SW4  9.53,54.61 90 top
SW5  7.62,34.29 0 top
U$1  [EURORACK_TEMPLATE]  -1.27,117.47 0 top  (outside the outline)
U$3  [ROHS_BIG]  88.9,32.7 0 bottom
UC1  30.48,69.85 270 top

### Tracks (layer width: path | path; a pad name or v marks a point on that pad's centre or on a via)
+3V3  (via drill 0.6)
  Top 0.254: SW1.B' SW1.B 24.13,95.56 v24.13,93.03 | UC1.36 36.62,72.6 C3.1 36.93,72.71 37.47,72.71 v38.1,73.34 | UC1.24 33.23,64.88 33.26,64.85 33.73,64.85 | 33.97,63.82 33.76,63.82 C10.1 33.66,64.77 33.73,64.85 | v34.29,65.41 33.73,64.85 | v38.1,79.38 38.1,80.64 39.05,81.6 JP4.1 | R10.2 25.51,72.6 UC1.1 26.41,72.78 C2.1 | C2.1 26.53,74.1 UC1.48 | C2.1 26.35,74.03 | v33.02,68.58 33.02,70.17 31.11,72.07 28.1,72.07 26.41,73.76 C2.1 | v24.77,77.47 26.41,75.83 C2.1 | v38.1,68.58 38.1,67.31 41.27,64.14 45.72,64.14 49.63,68.05 C6.1
  Top 0.406: IC1.2 59.03,69.83 57.15,67.94 56.02,67.94 C5.+ 52.32,67.8 C6.1 51.97,67.94
  Bottom 0.254: v34.29,65.41 33.02,66.67 v33.02,68.58 v38.1,68.58 v38.1,73.34 38.1,75.56 38.73,76.2 38.73,78.74 v38.1,79.38 | v24.77,77.47 24.13,78.11 v24.13,93.03
+3V3_A  (via drill 0.6)
  Top 0.254: C14.1 IC3.1 34.56,56.15 | R17.1 51.97,57.15 51.44,57.15 50.8,56.52 50.8,54.61 51.44,53.98 | C7.1 23.81,67.25 23.81,67.94 24.47,68.6 UC1.9
  Top 0.305: 51.44,53.98 50.8,53.98 49.53,55.24 49.53,56.52 48.26,57.78 40.01,57.78 38.73,56.52 34.92,56.52 34.56,56.15 | C16.1 51.97,53.76 | D3.2 73.17,50.16 58.42,50.16 55.88,52.7 C15.+ 56.02,53.83 58.42,51.44 66.67,51.44 68.58,53.34 v68.58,60.01 | v69.22,69.53 71.12,71.44 71.12,76.2 73.66,78.74 79.38,78.74 80.64,80.01 80.64,86.31 R5.P$1 80.61,87.67 78.42,89.85 57.78,89.85 | v12.06,90.49 12.7,89.85 34.92,89.85 | 57.78,89.85 v57.78,90.17 | 57.78,89.85 34.92,89.85 | 34.92,89.85 v34.92,90.17 | C13.1 31.81,54.93 29.53,54.93 28.57,53.98 25.72,53.98 v25.4,53.66 | C7.1 C8.1 23.71,64.35 v23.5,64.14
  Top 0.406: C13.1 C14.1 | IC4.2 59.03,55.85 57.15,53.98 56.02,53.98 C15.+ 55.81,53.76 C16.1 51.85,53.98 51.44,53.98 48.9,53.98 46.99,55.88 46.33,55.88 R14.P$1
  Bottom 0.305: v69.22,69.53 68.58,68.9 v68.58,60.01 | R2.P$1 12.06,86.39 v12.06,90.49 | R4.P$1 57.78,86.39 v57.78,90.17 | R3.P$1 34.92,86.39 v34.92,90.17 | v25.4,53.66 25.4,59.69 23.5,61.59 v23.5,64.14
ADD_SWITCH  (via drill 0.6)
  Top 0.254: SW3.A1 SW3.A2 | v6.99,61.59 7.62,61.59 9.53,59.69 9.53,56.2 10.48,55.24 28.1,55.24 29.69,56.83 29.69,58.58 31.73,60.62 UC1.21
  Bottom 0.254: SW3.A1 6.99,68.58 v6.99,61.59
AREF_2.5
  Top 0.254: C12.1 51.97,60.64 51.12,60.64 48.9,58.42 39.69,58.42 39.05,57.78 36.51,57.78 36.06,58.24 IC3.7 | C12.1 R17.2 | C12.1 52.14,60.81 IC2.1
AREF_5
  Top 0.254: IC6.2 7.94,42.17 IC6.1 5.97,42.17 5.08,41.27 JP1.1
AREF_10
  Top 0.254: IC6.7 IC6.6 9.84,48.58 10.16,48.9 13.34,48.9 14.61,47.62 14.61,40.01 13.34,38.73 JP1.3
AREF_10_0
  Top 0.254: R27.2 11.27,47.52 IC6.5 11.11,46.04 10.94,45.87 IC5.1 5.54,46.04 5.4,46.04 4.23,47.2 R26.2
BOOT_FLASH  (via drill 0.6)
  Top 0.254: SW1.A' SW1.A 25.18,98.96 R1.2 25.18,97.37 25.72,96.84 26.19,96.84 26.35,96.68 26.35,94.93 25.4,93.98 v25.4,92.39 | v25.4,80.8 26.83,80.8 29.73,77.9 UC1.44
  Bottom 0.254: v25.4,80.8 24.77,81.44 24.77,91.76 v25.4,92.39
DAC_MOSI
  Top 0.254: IC3.8 35.56,62.23 37.47,64.14 37.47,66.99 35.86,68.6 UC1.28
DAC_SCK
  Top 0.254: UC1.26 34.7,67.63 33.81,67.63 33.5,67.31 33.5,66.83 33.81,66.52 35.4,66.52 36.51,65.41 36.51,64.77 34.56,62.82 IC3.10
DAC_SS
  Top 0.254: IC3.9 35.08,59.29 35.08,62.55 36.99,64.45 36.99,66.52 36.41,67.1 UC1.25
DEL_SWITCH
  Top 0.254: SW4.A1 7.03,54.61 | 7.03,54.61 SW4.A2 | UC1.22 32.23,60.33 30.16,58.26 30.16,56.52 28.26,54.61 7.03,54.61
FB_CURRENT
  Top 0.254: R54.2 R55.2 47.31,33.34 46.99,33.66 IC10.2
FB_CURRENT1
  Top 0.254: R33.2 R34.2 47.31,41.59 46.99,41.27 IC10.15
FB_CURRENT2
  Top 0.254: IC10.10 53.34,41.27 53.02,41.59 R35.2 R36.2
FB_CURRENT3
  Top 0.254: R57.2 R56.2 53.02,33.34 53.34,33.66 IC10.7
FRAME_CHANGE  (via drill 0.6)
  Top 0.254: UC1.16 29.21,65.58 29.21,64.14 28.57,63.5 28.57,59.05 29.21,58.42 29.21,57.15 27.94,55.88 20.64,55.88 v20.32,56.2 | R23.1 v20.32,52.7
  Bottom 0.254: v20.32,52.7 v20.32,56.2
GAIN_1  (via drill 0.6)
  Top 0.254: R19.2 C17.1 32.7,49.21 33.34,48.58 37.94,48.58 38.89,47.62 41.27,47.62 42.55,46.35 42.55,41.27 42.55,40.96 v41.91,40.32 | v42.55,36.2 42.86,36.51 47.94,36.51 48.26,36.2 IC10.3
  Bottom 0.254: v42.55,36.2 42.55,39.05 42.55,39.69 v41.91,40.32
GAIN_2
  Top 0.254: IC10.14 48.26,41.27 48.9,41.91 49.53,41.91 49.85,42.23 49.85,46.67 48.26,48.26 39.21,48.26 38.42,49.05 36.04,49.05 35.88,49.21 C18.1 R20.2
GAIN_3
  Top 0.254: IC10.11 52.07,41.43 51.59,41.91 50.8,41.91 50.48,42.23 50.48,46.99 48.58,48.9 39.37,48.9 39.05,49.21 C19.1 R21.2
GAIN_4  (via drill 0.6)
  Top 0.254: IC10.6 52.07,36.2 52.39,36.51 57.15,36.51 v57.47,36.2 | v57.78,41.27 57.78,46.99 55.3,49.47 43.71,49.47 43.18,50.01 42.44,50.01 C20.1 R22.2
  Bottom 0.254: v57.47,36.2 57.47,40.01 57.78,40.32 v57.78,41.27
GATE2_LED
  Top 0.254: LED3.A 53.12,82.77 R8.2
GATE3_LED
  Top 0.254: LED2.A 32.38,83.19 34.29,83.19 34.71,82.77 R7.2
GATE4_LED
  Top 0.254: LED1.A 9.53,80.64 11.43,80.64 11.85,81.06 R6.2
GND  (via drill 0.6)
  Top 0.254: UC1.35 33.66,72.1 33.66,72.07 v32.7,72.07 | 28.26,74.1 UC1.47 28.26,74.13 28.26,75.88 v27.3,76.83 | UC1.20 31.23,66.47 | C10.2 33.55,61.91 33.02,61.91 32.73,62.2 UC1.23 | C7.2 21.91,67.25 21.91,67.94 23.06,69.1 UC1.8
  other vias: 81.28,52.07 74.3,71.12 65.41,60.96 60.33,46.35 68.58,46.35 73.66,43.81 73.98,35.56 66.04,35.56 56.2,46.35 44.13,46.35 36.83,46.35 28.26,46.35 16.51,41.59 26.04,35.56 42.55,34.61 76.83,37.78 21.59,37.47 35.24,34.77 48.26,46.35 52.07,46.35 39.05,53.02 35.88,53.02 32.7,53.02 52.07,64.14 53.98,57.78 53.98,71.75 16.51,70.48 35.24,74.61 30.16,67.63 41.59,41.91 21.59,80.01 20.95,90.81 29.21,90.81 27.94,87 33.34,60.33 29.84,53.66 28.73,69.69 23.81,75.41 29.84,25.72 33.34,25.72 39.37,26.04 47.62,26.04 62.23,26.04 54.93,26.04 72.07,26.04 79.38,28.57 42.39,53.02 48.26,52.7 50.16,31.11 59.05,35.56 50.16,37.47 34.29,40.01 66.04,40.01 38.1,38.1 38.1,59.69 1.27,55.88 5.08,100.33 35.56,100.33 45.72,100.33 55.88,100.33 66.04,100.33 76.2,100.33 87.63,86.36 87.63,15.24 87.63,5.08 1.27,25.4 1.27,66.04 1.27,15.24 15.24,1.27 25.4,1.27 45.72,1.27 55.88,1.27 76.2,1.27 1.27,76.2 1.27,86.36 1.27,96.52 87.63,96.52 16.51,35.56 42.07,26.04 29.84,37.15 69.85,37.47 66.04,86.36 45.72,86.36 21.27,82.87 26.67,83.82 62.55,70.8 62.55,69.22 58.1,72.39 64.14,70.8 64.14,72.39 62.55,54.93 62.55,56.52 62.55,58.1 60.33,60.01 64.14,69.22 62.55,67.63 64.14,67.63 62.55,66.04 12.7,41.27 1.27,45.72
  pour Bottom: 0,101.6 0,0 88.9,0 88.9,101.6
  pour Top (isolate 0.203): 0,101.6 0,0 88.9,0 88.9,101.6
IN_1  (via drill 0.6)
  Top 0.254: R54.1 45.62,30.16 v44.29,30.16 | v17.46,17.78 17.78,18.1 43.34,18.1 v43.66,17.78
  Bottom 0.254: v44.29,30.16 43.81,29.69 43.81,25.72 44.13,25.4 44.13,22.86 43.18,21.91 43.18,18.26 v43.66,17.78 | J2.TIP 17.46,20.92 v17.46,17.78
IN_2  (via drill 0.6)
  Top 0.254: R33.1 45.72,45.72 v46.35,46.35 | v44.77,19.68 43.97,19.68 43.5,20.16 41.91,21.75 40.64,23.02 38.73,23.02 36.67,20.95 J3.TIP
  Bottom 0.254: v46.35,46.35 46.35,23.5 44.77,21.91 v44.77,19.68
IN_3  (via drill 0.6)
  Top 0.254: J4.TIP 47.27,21.59 v51.75,21.59 | v53.98,46.35 54.61,45.72 R36.1
  Bottom 0.254: v51.75,21.59 53.98,23.81 v53.98,46.35
IN_4  (via drill 0.6)
  Top 0.254: R57.1 54.71,30.16 v56.04,30.16 | v56.52,20.95 J5.TIP
  Bottom 0.254: v56.04,30.16 56.52,29.69 56.52,23.81 56.2,23.5 56.2,21.91 56.52,21.59 v56.52,20.95
JTCK  (via drill 0.6)
  Top 0.254: v40.64,76.52 40.32,76.83 34.77,76.83 33.23,75.3 UC1.37
  Bottom 0.254: v40.64,76.52 40.01,77.15 40.01,79.06 40.64,79.69 JP4.4
JTDI
  Top 0.254: JP4.8 43.18,79.06 41.59,77.47 34.61,77.47 32.73,75.59 UC1.38
JTDO
  Top 0.254: JP4.6 41.91,79.06 40.96,78.11 34.45,78.11 32.23,75.89 UC1.39
JTMS  (via drill 0.6)
  Top 0.254: v39.37,74.93 39.37,73.34 37.63,71.6 UC1.34
  Bottom 0.254: v39.37,74.93 JP4.2
LED_B  (via drill 0.6)
  Top 0.254: v30.16,60.96 29.84,61.28 29.84,62.87 30.23,63.25 UC1.18 | v43.81,66.36 R12.1
  Bottom 0.254: v30.16,60.96 31.11,60.96 32.38,62.23 34.92,62.23 39.37,66.67 43.5,66.67 v43.81,66.36
LED_CH1
  Top 0.254: R6.1 12.8,82.87 18.41,82.87 20.32,80.96 22.54,80.96 24.29,79.22 26.83,79.22 28.73,77.31 UC1.46
LED_CH2
  Top 0.254: R7.1 | R7.1 35.56,80.33 35.24,80.01 28.57,80.01 26.67,81.92 25.08,81.92 24.45,81.28 24.45,80.17 24.92,79.69 27.15,79.69 29.23,77.61 UC1.45
LED_CH3
  Top 0.254: R8.1 51.97,80.96 48.26,80.96 45.4,83.82 37.78,83.82 36.51,82.55 36.51,80.01 35.88,79.38 31.43,79.38 30.23,78.17 UC1.43
LED_CH4
  Top 0.254: R9.1 74.83,80.96 58.42,80.96 57.47,80.01 51.12,80.01 50.8,80.33 47.94,80.33 45.09,83.19 38.1,83.19 37.15,82.23 37.15,79.69 36.2,78.74 31.75,78.74 30.73,77.72 UC1.42
LED_FRAME  (via drill 0.6)
  Top 0.254: R16.1 14.61,60.96 13.97,61.59 12.38,61.59 8.57,65.41 8.57,75.88 6.67,77.79 6.67,81.92 9.21,84.45 13.02,84.45 13.97,83.5 18.73,83.5 20.64,81.6 23.81,81.6 24.77,82.55 26.99,82.55 28.89,80.64 32.07,80.64 v32.38,80.96 | v32.38,77.79 31.23,76.63 UC1.41
  Bottom 0.254: v32.38,80.96 v32.38,77.79
LED_G  (via drill 0.6)
  Top 0.254: v41.91,65.72 R11.1 | v29.53,59.69 29.21,60.01 29.21,63.18 29.73,63.7 UC1.17
  Bottom 0.254: v41.91,65.72 41.59,66.04 39.69,66.04 35.24,61.59 32.7,61.59 30.8,59.69 v29.53,59.69
LED_R  (via drill 0.6)
  Top 0.254: v45.72,67.31 R13.1 | v30.8,62.23 30.73,62.3 UC1.19
  Bottom 0.254: v30.8,62.23 31.43,62.23 32.07,62.87 34.61,62.87 39.05,67.31 v45.72,67.31
MODULATION  (via drill 0.6)
  Top 0.254: v45.09,51.12 55.24,51.12 58.74,47.62 74.12,47.62 D3.3 74.3,46.67 75.56,45.4 R39.1 | v27.3,51.44 28.89,49.85 28.89,48.9 30.48,47.31 37.47,47.31 39.05,45.72 40.32,45.72 v40.96,45.09 | UC1.14 28.23,64.74 27.3,63.82 27.3,58.74 v26.99,58.42
  Bottom 0.254: v45.09,51.12 45.09,49.21 v40.96,45.09 | v27.3,51.44 27.3,53.34 27.62,53.66 27.62,56.83 27.3,57.15 27.3,58.1 v26.99,58.42
N$1
  Top 0.254: R64.2 IC13.2 78.11,36.2 78.42,36.51 81.92,36.51 83.82,38.42 83.82,46.99 82.87,47.94 80.01,47.94 78.11,49.85 78.11,55.83 R15.P$1
N$2
  Top 0.254: R55.1 C42.1
N$3
  Top 0.254: 17.36,44.77 R28.2 17.46,47.94 15.24,50.16 7.62,50.16 6.35,48.9 3.81,48.9 3.17,48.26 3.17,46.99 2.54,46.35 2.54,38.1 5.4,35.24 5.4,26.99 1.27,22.86 1.27,17.78 2.82,16.23 J7.TIP
N$4  (via drill 0.6)
  Top 0.254: IC9.7 38.1,44.45 38.42,44.77 38.95,44.77 R32.2 39.79,44.66 40.64,43.81 v40.64,43.18 | R53.1 39.69,29.21 v40.01,28.89
  Bottom 0.254: v40.01,28.89 39.69,29.21 39.69,42.23 v40.64,43.18
N$5
  Top 0.254: R15.P$2 75.56,56.83 76.2,57.47 79.06,57.47 80.64,55.88 R18.2
N$6
  Top 0.254: LED4.A 75.98,82.77 R9.2
N$7
  Top 0.254: UC1.5 19.25,70.6 18.41,71.44 Q1.2 15.81,76.58 14.92,77.47 C1.2
N$8
  Top 0.254: UC1.6 18.98,70.1 18.41,69.53 Q1.1 15.81,66.93 14.92,66.04 C9.2
N$9
  Top 0.254: R64.1 78,30.16 77.47,30.16 76.83,30.8 IC13.1 76.83,36.2 77.79,37.15 81.6,37.15 83.19,38.73 83.19,46.67 82.55,47.31 80.96,47.31 80.33,46.67 R41.2
N$10
  Top 0.254: C27.1 53.02,44.55 R35.1
N$11  (via drill 0.6)
  Top 0.254: R18.1 80.54,53.66 79.69,53.66 78.74,52.7 78.74,50.16 80.33,48.58 83.19,48.58 84.45,47.31 84.45,26.67 v83.82,26.04 | J6.TIP v81.6,20.95
  Bottom 0.254: v83.82,26.04 81.92,24.13 81.92,21.27 v81.6,20.95
N$12
  Top 0.254: IC10.4 49.53,36.2 48.58,37.15 32.38,37.15 30.8,38.73 IC8.6 R31.1
N$13
  Top 0.254: IC13.7 78.11,41.27 78.74,41.91 R40.1 C31.2 R39.2
N$14
  Top 0.254: R15.P$3 73.03,55.83 73.03,54.61 73.66,53.98 76.83,53.98 77.47,53.34 77.47,49.53 78.74,48.26 R40.2 | R41.1 R42.1 | IC13.6 79.38,41.27 80.33,42.23 R41.1 | R41.1 78.74,44.55 R40.2 | R40.2 C31.1
N$15
  Top 0.254: R49.1 R50.2 | C39.1 R49.1 | R49.1 IC8.2
N$16
  Top 0.254: R49.2 C39.2 26.35,31.85 R48.1 26.35,32.7 26.67,33.02 27.62,33.02 28.26,33.66 IC8.1
N$17
  Top 0.254: IC7.7 19.68,41.27 19.05,41.91 17.78,41.91 17.46,42.23 R28.1 19.05,44.55 C23.2 R29.2
N$18
  Top 0.254: C22.1 47.31,44.55 R34.1
N$19
  Top 0.254: R44.2 R43.1 C38.1 | R44.2 R45.2 R46.2 R47.2 | IC7.2 19.68,33.66 18.73,32.7 R44.2
N$20
  Top 0.254: IC10.13 49.53,38.73 49.21,38.42 39.69,38.42 39.37,38.73 IC9.6 39.37,41.27 39.05,41.59 R32.1
N$21
  Top 0.254: IC7.6 20.95,41.59 20.64,41.91 R29.1 | R29.1 R30.2 | R29.1 C23.1
N$22
  Top 0.254: R52.1 R53.2 | C40.1 R52.1 | R52.1 IC9.2
N$23
  Top 0.254: R52.2 C40.2 34.92,31.85 R51.1 34.92,32.7 35.24,33.02 36.2,33.02 36.83,33.66 IC9.1
N$24
  Top 0.254: IC10.12 50.8,38.73 51.12,38.42 62.55,38.42 62.87,38.73 IC11.6 R37.1
N$25
  Top 0.254: R16.2 18.41,60.96 19.68,62.23 LED6.A
N$26
  Top 0.254: R59.1 R60.2 | R59.1 IC11.2 | C44.1 R59.1
N$27
  Top 0.254: R59.2 C44.2 58.42,31.85 R58.1 58.42,32.7 58.74,33.02 59.69,33.02 60.33,33.66 IC11.1
N$28
  Top 0.254: R56.1 C43.1
N$29
  Top 0.254: R30.1 22.96,44.66 23.18,44.45 23.18,42.23 22.86,41.91 21.91,41.91 21.59,41.59 21.59,38.73 21.27,38.42 20.64,38.42 18.41,36.2 IC7.1 18.36,34.87 18.41,34.8 18.41,33.66 17.78,33.02 14.92,33.02 14.61,32.7 14.61,30.48 14.82,30.27 C38.2 R43.2
N$30
  Top 0.254: IC10.5 50.8,36.2 51.75,37.15 67.31,37.15 68.58,38.42 70.8,38.42 71.12,38.73 IC12.6 R38.1
N$31
  Top 0.254: R27.1 R65.2 10.69,44.35 9.84,43.5 IC6.3
N$32
  Top 0.254: R62.1 IC12.2 | R62.1 R63.2 | C46.1 R62.1
N$33
  Top 0.254: R62.2 C46.2 66.67,31.85 R61.1 66.67,32.7 66.99,33.02 67.94,33.02 68.58,33.66 IC12.1
N$34
  Top 0.254: SW5.P 7.62,30.48 10.92,27.18 J1.SW
N$35
  Top 0.254: R13.2 LED5.RED
N$36
  Top 0.254: R12.2 43.18,71.65 LED5.BLU
N$37
  Top 0.254: R11.2 LED5.GRN
N$39
  Top 0.254: R19.1 31.11,53.34 31.75,53.98 34.61,53.98 35.06,54.43 IC3.2
N$40  (via drill 0.6)
  Top 0.254: J8.TIP 17.46,6.39 17.46,11.43 20,13.97 24.77,13.97 v26.99,16.19 | v26.99,28.89 26.35,29.53 R48.2
  Bottom 0.254: v26.99,16.19 27.3,16.51 27.3,26.67 27.3,26.99 26.99,27.3 v26.99,28.89
N$41
  Top 0.254: R20.1 34.29,52.86 35.56,54.13 IC3.3
N$42
  Top 0.406: JP1.2 7.62,37.47 8.57,36.51 11.11,36.51 12.32,35.31 SW5.S
N$43
  Top 0.254: R21.1 37.47,52.7 36.06,54.11 IC3.4
N$44  (via drill 0.6)
  Top 0.254: R25.1 R24.2 25.61,49.85 24.77,49.85 24.62,49.99 Q2.C 23.43,49.74 23.18,49.49 23.18,45.4 23.81,44.77 23.81,41.91 23.18,41.27 v23.18,38.1 | v25.08,12.38 25.08,9.84 31.43,3.49 74.61,3.49 75.84,4.72 J12.TIP
  Bottom 0.254: v23.18,38.1 23.18,28.89 23.81,28.26 23.81,25.08 22.23,23.5 22.23,20 25.08,17.14 v25.08,12.38
N$45
  Top 0.254: R22.1 40.64,52.7 39.37,53.98 37.15,53.98 36.56,54.56 IC3.5
N$47
  Top 0.254: R23.2 20.57,47.8 Q2.B
N$48
  Top 0.254: IC12.7 69.85,44.13 70.48,44.77 71.02,44.77 R38.2 71.86,44.66 72.07,44.45 72.07,42.23 71.75,41.91 71.75,33.34 72.39,32.7 72.39,30.48 72.07,30.16 71.54,30.16 R63.1
N$49  (via drill 0.6)
  Top 0.254: v33.66,16.19 32.03,14.57 J9.TIP | v33.5,29.37 34.39,30.27 R51.2
  Bottom 0.254: v33.5,29.37 34.29,28.57 34.29,18.1 33.66,17.46 v33.66,16.19
N$50  (via drill 0.6)
  Top 0.254: v69.22,17.14 69.22,15.56 67.63,13.97 64.77,13.97 61.24,10.44 J11.TIP | v67.47,28.73 66.67,29.53 R61.2
  Bottom 0.254: v69.22,17.14 67.47,18.89 | 67.47,18.89 | 67.47,18.89 v67.47,28.73
N$51  (via drill 0.6)
  Top 0.254: v58.74,17.78 54.93,13.97 50.8,13.97 46.63,9.8 J10.TIP | v58.74,28.57 58.42,28.89 R58.2
  Bottom 0.254: v58.74,17.78 v58.74,28.57
N$56
  Top 0.406: JP2.2 JP2.1 86.49,76.97 P1.2
N$64
  Top 0.406: JP2.10 JP2.9 86.49,65.28 P2.2
PAN
  Top 0.254: J1.TIP 2.86,20.92 2.86,19.05 3.17,18.73 25.4,18.73 | 25.4,18.73 40.01,18.73 | 40.01,18.73 54.61,18.73 | 54.61,18.73 68.26,18.73 69.34,19.81 J5.SW | J4.SW 54.61,20.83 54.61,18.73 | J3.SW 40.01,20.83 40.01,18.73 | J2.SW 25.4,20.83 25.4,18.73
POT_CH1
  Top 0.254: UC1.10 25.24,68.1 24.87,67.73 24.87,62.02 22.54,59.69 14.92,59.69 13.65,60.96 12.06,60.96 5.4,67.63 5.4,81.6 9.53,85.72 R2.P$2
POT_CH2
  Top 0.254: R3.P$2 32.38,87.31 31.75,87.95 5.71,87.95 4.76,87 4.76,67.31 11.75,60.33 13.34,60.33 14.61,59.05 22.86,59.05 25.35,61.54 25.35,67.42 25.53,67.6 UC1.11
POT_CH3
  Top 0.254: R4.P$2 55.24,87.31 53.98,88.58 5.4,88.58 4.13,87.31 4.13,66.99 11.43,59.69 13.02,59.69 14.29,58.42 23.18,58.42 25.88,61.12 25.88,66.75 UC1.12
POT_CH4
  Top 0.254: R5.P$2 78.11,87.63 76.52,89.22 5.08,89.22 3.49,87.63 3.49,66.67 11.11,59.05 12.7,59.05 13.97,57.78 23.5,57.78 26.35,60.64 26.35,64.45 27.5,65.6 UC1.13
POT_FRAME  (via drill 0.6)
  Top 0.254: v43.81,53.18 R14.P$2 | v40.96,46.67 38.89,46.67 37.62,47.94 30.8,47.94 29.53,49.21 29.53,50.01 28.26,51.28 v28.26,52.39 | UC1.15 28.73,64.45 27.94,63.66 27.94,58.1 v28.26,57.78
  Bottom 0.254: v43.81,53.18 44.13,52.86 44.13,49.21 41.59,46.67 v40.96,46.67 | v28.26,52.39 v28.26,57.78
RESET  (via drill 0.6)
  Top 0.254: SW2.B 24.45,87 26.04,87 28.57,84.45 45.4,84.45 v45.72,84.77 | v22.86,83.66 24.36,85.16 SW2.B | v20.95,69.22 21.34,69.6 UC1.7 | v20.95,71.75 R10.1 22.86,71.86 v22.86,78.11 | SW2.B SW2.B'
  Bottom 0.254: v22.86,78.11 23.65,78.9 23.65,82.87 v22.86,83.66 | v20.95,69.22 v20.95,71.75 | JP4.10 45.09,80.33 45.72,80.96 v45.72,84.77
RX
  Top 0.254: UC1.31 36.92,70.1 41.75,74.93 58.42,74.93 59.69,76.2 JP3.4
TX
  Top 0.254: UC1.30 37.22,69.6 41.91,74.3 60.33,74.3 62.23,76.2 JP3.5
VCA0_1
  Top 0.254: R31.2 30.06,44.66 29.53,44.13 IC8.7 29.53,38.73 31.43,36.83 31.43,33.34 32.07,32.7 32.07,30.48 31.75,30.16 31.22,30.16 R50.1
VCA0_3  (via drill 0.6)
  Top 0.254: IC11.7 61.59,44.13 62.23,44.77 62.76,44.77 R37.2 63.6,44.66 64.45,43.81 v64.45,42.55 | R60.1 63.18,29.21 v62.55,28.57
  Bottom 0.254: v62.55,28.57 63.18,29.21 63.18,41.27 v64.45,42.55
VCA_1  (via drill 0.6)
  Top 0.254: R44.1 18.73,29.53 14.92,25.72 v14.92,21.59 | v14.92,15.88 14.92,5.4 16.51,3.81 24.13,3.81 25.52,5.21 J8.SW
  Bottom 0.254: v14.92,15.88 v14.92,21.59
VCA_2  (via drill 0.6)
  Top 0.254: R47.1 23.5,29.53 25.08,27.94 34.61,27.94 34.92,28.26 35.24,28.26 37.78,28.26 v38.1,28.57 | v40.01,15.88 40.13,15.75 J9.SW
  Bottom 0.254: v38.1,28.57 38.42,28.26 38.42,24.13 38.1,23.81 38.1,19.37 40.01,17.46 v40.01,15.88
VCA_3  (via drill 0.6)
  Top 0.254: R46.1 21.91,29.53 22.23,29.21 22.86,29.21 24.77,27.3 34.92,27.3 35.24,27.62 48.58,27.62 v48.9,27.94 | v48.9,17.78 45.09,13.97 45.09,4.76 45.72,4.13 53.34,4.13 54.73,5.52 J10.SW
  Bottom 0.254: v48.9,17.78 v48.9,27.94
VCA_4  (via drill 0.6)
  Top 0.254: v70.8,27.3 70.48,26.99 36.2,26.99 35.56,26.99 35.24,26.67 24.45,26.67 22.54,28.57 21.27,28.57 20.32,29.53 R45.1 | v71.12,18.41 71.12,9.14 69.34,7.36 J11.SW
  Bottom 0.254: v70.8,27.3 70.8,23.5 71.12,23.18 v71.12,18.41
VCC  (via drill 0.6)
  Top 0.254: R25.2 27.3,43.18 27.52,42.97 C24.1
  Top 0.305: IC6.8 7.3,48.9 7.94,49.53 13.65,49.53 15.24,47.94 15.24,38.1
  Top 0.406: 72.39,69.85 72.39,74.93 73.66,76.2 76.06,76.2 C4.+ 76.34,76.2 78.74,76.2 81.92,79.38 82.55,79.38 | IC4.3 63.09,53.57 64.45,54.93 64.45,58.1 60.81,61.74 C11.+ | 72.39,69.85 77.47,64.77 77.47,61.28 83.82,54.93 83.82,48.9 85.41,47.31 85.41,26.04 83.5,24.13 75.25,24.13 | 45.72,40.32 IC10.16 44.19,40.06 v44.13,40.01 C26.1 | v17.78,26.04 19.68,24.13 28.26,24.13 | 28.26,24.13 35.24,24.13 | 35.24,24.13 v35.24,24.45 | 35.24,24.13 37.47,24.13 38.1,24.77 v43.18,24.77 43.81,24.13 60.33,24.13 | 60.33,24.13 69.22,24.13 | 28.26,24.13 v28.26,24.77 | IC8.8 C24.1 27.73,42.97 27.3,42.55 27.3,38.73 v28.26,37.78 | 60.33,24.13 v60.33,24.77 | IC11.8 C29.1 60.22,42.86 59.69,42.86 59.37,42.55 59.37,40.64 59.05,40.32 v59.05,39.37 | 69.22,24.13 v69.22,25.4 | IC12.8 C30.1 68.05,42.97 67.31,42.23 v67.31,39.37 | 72.39,69.85 67.63,65.09 63.18,65.09 60.96,62.87 C11.+ | 82.55,79.38 P1.1 | D1.C 82.55,79.38 | IC9.8 C25.1 36.3,42.97 35.56,42.23 v35.56,39.37 | IC1.3 60.81,67.07 C11.+ | 18.41,40.64 IC7.8 18.41,38.73 17.78,38.1 16.61,38.1 C35.1 16.41,38.1 15.24,38.1 v15.24,36.51 | 76.78,40.01 IC13.8 75.84,40.06 C34.1 75.56,38.73 75.25,38.42 75.25,24.13 | 69.22,24.13 75.25,24.13 | R26.1 7.3,47.62 IC6.8
  Bottom 0.406: v17.78,26.04 15.24,28.57 v15.24,36.51 | v28.26,24.77 v28.26,37.78 | v35.24,24.45 35.24,27.94 36.51,29.21 36.51,38.42 v35.56,39.37 | v43.18,24.77 43.18,33.02 44.13,33.97 v44.13,40.01 | v60.33,24.77 60.33,38.1 v59.05,39.37 | v67.31,39.37 67.31,31.75 69.22,29.84 v69.22,25.4
VEE  (via drill 0.6)
  Top 0.254: v81.92,46.35 R42.2 | 86.36,46.35 v87,46.35
  Top 0.305: IC6.4 11.11,40.96 12.38,39.69 v12.7,39.69 | v23.81,22.86 23.5,23.18 19.37,23.18 17.78,24.77 17.14,24.77 16.51,25.4 v16.19,25.4
  Top 0.406: P2.1 82.56,61.73 D2.A 82.55,59.37 86.36,55.56 86.36,50.16 | 29.21,23.18 24.13,23.18 v23.81,22.86 | 29.21,23.18 37.62,23.18 38.26,23.81 41.43,23.81 v42.07,23.18 57.15,23.18 | 57.15,23.18 64.45,23.18 | 64.45,23.18 73.66,23.18 | 73.66,23.18 78.11,23.18 | 78.11,23.18 84.14,23.18 86.36,25.4 86.36,46.35 86.36,50.16 | 57.15,23.18 v57.15,22.54 | v55.88,40.01 56.2,40.32 56.2,41.91 | 56.2,41.91 C28.2 | 64.77,33.02 64.14,33.66 IC11.4 | 64.77,33.02 C45.2 | v65.09,33.34 64.77,33.02 | 64.45,23.18 v64.45,22.54 | IC12.4 72.39,33.97 73.34,33.02 | v73.66,33.34 73.34,33.02 | 73.66,23.18 v73.66,22.54 | 73.34,33.02 C47.2 | 78.11,23.18 v78.11,22.54 | IC13.4 C48.2 81.38,31.96 81.92,31.43 81.92,29.21 v78.11,25.4 | 29.21,23.18 v29.21,22.54 | 41.27,33.02 C41.2 | v41.59,33.34 41.27,33.02 | IC9.4 40.64,33.66 41.27,33.02 | 86.36,50.16 C21.- | 54.67,40.01 IC10.9 54.61,41.27 55.24,41.91 56.2,41.91 | IC7.4 22.29,34.87 22.86,34.29 23.71,34.29 C37.2 23.91,34.29 24.45,34.29 v25.08,33.66 | v33.02,33.02 33.66,33.66 C36.2 33.44,34.61 32.7,34.61 32.45,34.87 IC8.4
  Bottom 0.254: v87,46.35 v81.92,46.35
  Bottom 0.305: v12.7,39.69 13.97,38.42 13.97,35.88 14.61,35.24 14.61,27.94 16.19,26.35 v16.19,25.4
  Bottom 0.406: v55.88,40.01 55.88,34.29 57.15,33.02 v57.15,22.54 | v64.45,22.54 64.45,32.7 v65.09,33.34 | v73.66,22.54 v73.66,33.34 | v78.11,22.54 v78.11,25.4 | v25.08,33.66 25.08,24.13 v23.81,22.86 | v29.21,22.54 31.43,24.77 31.43,31.43 v33.02,33.02 | 41.43,33.18 v41.59,33.34 | 41.43,33.18 41.43,29.84 41.91,29.37 41.91,28.26 40.96,27.3 40.96,24.13 41.91,23.18 v42.07,23.18 | 41.43,33.18

### Text on the board
tPlace: Frames
bPlace: Frames | Red | stripe | +5V | +10V
tNames: SYSBOOT | RESET | cc-by-sa Olivier Gillet, 2013. v0.3
bNames: cc-by-sa Olivier Gillet, 2013. v0.3 | mini JTAG | JTMS | JTCK | JTDO | JTDI | RESET | FTDI dongle | +12V | GND | RX< | TX> | GND | GND | GND | -12V